# EAGLE board Module_BaseBoard _2.0 (EAGLE 9.2.1), part 1 of 3
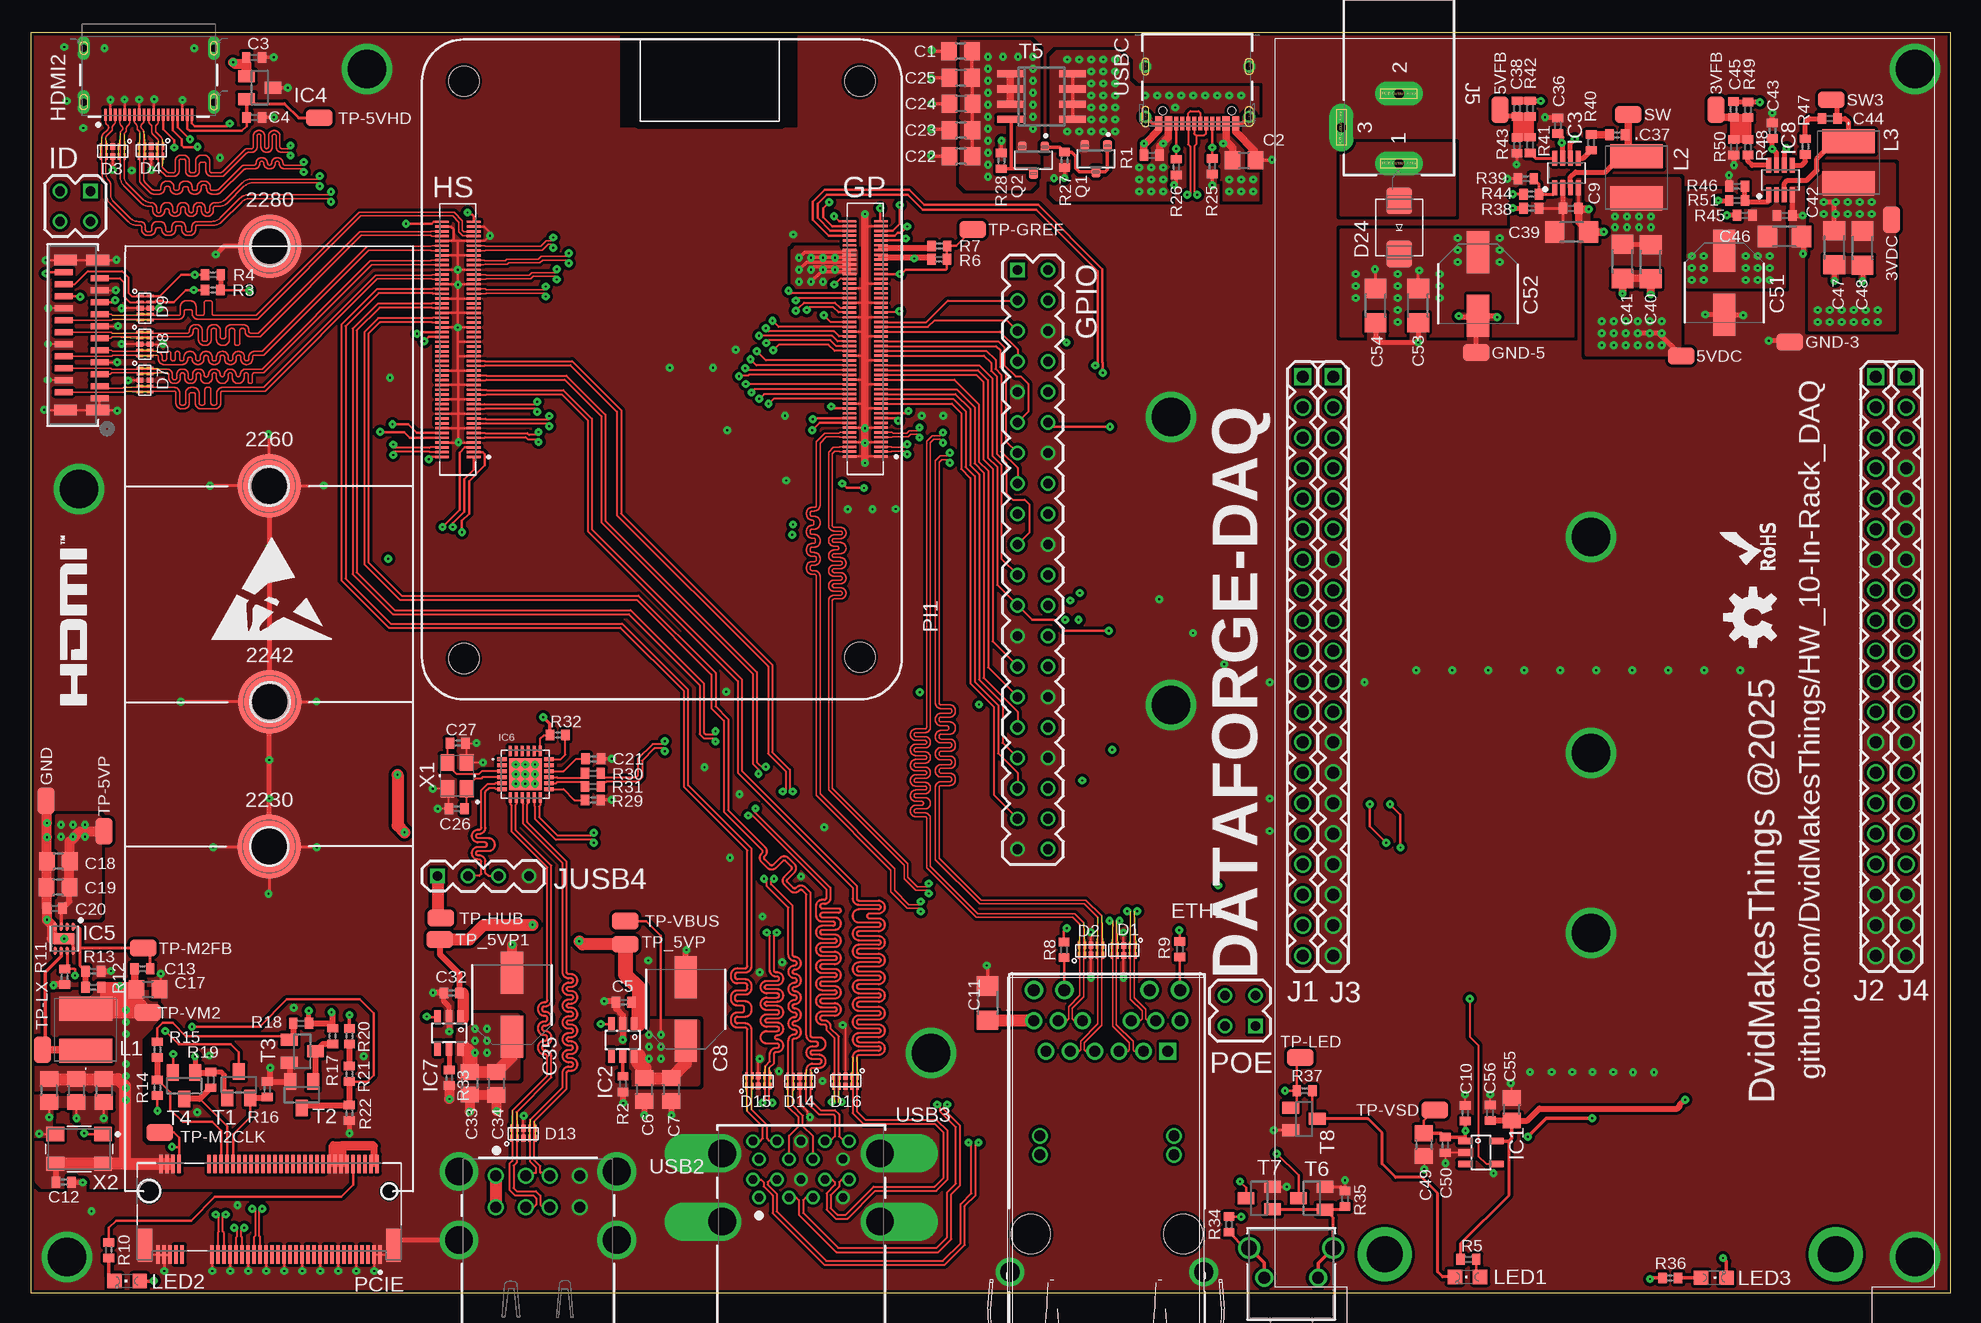
[diagram p7: board, top side]
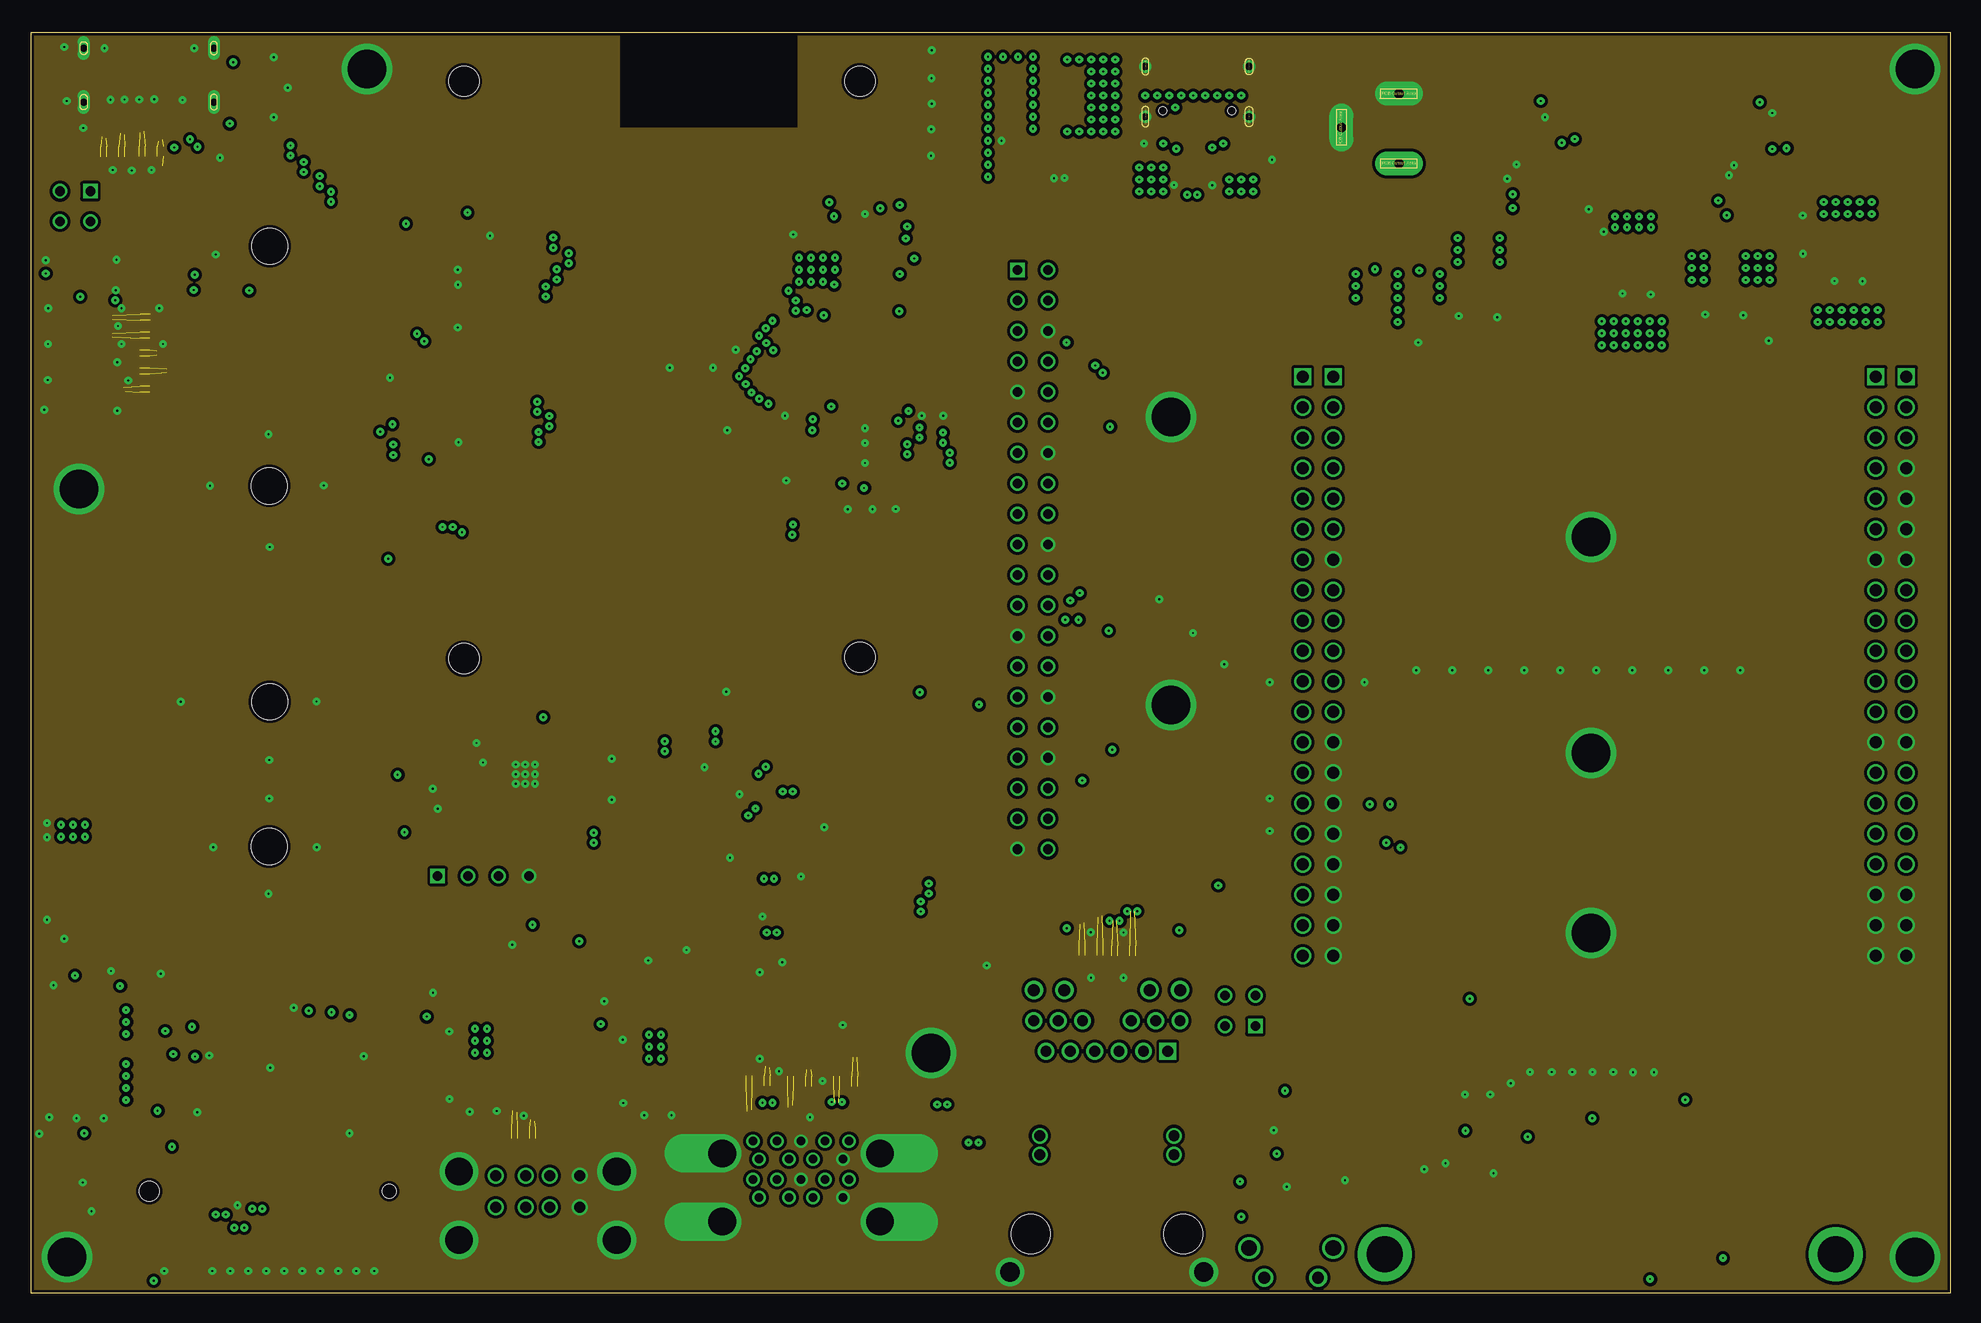
[diagram p8: board, inner layer L2-GND]
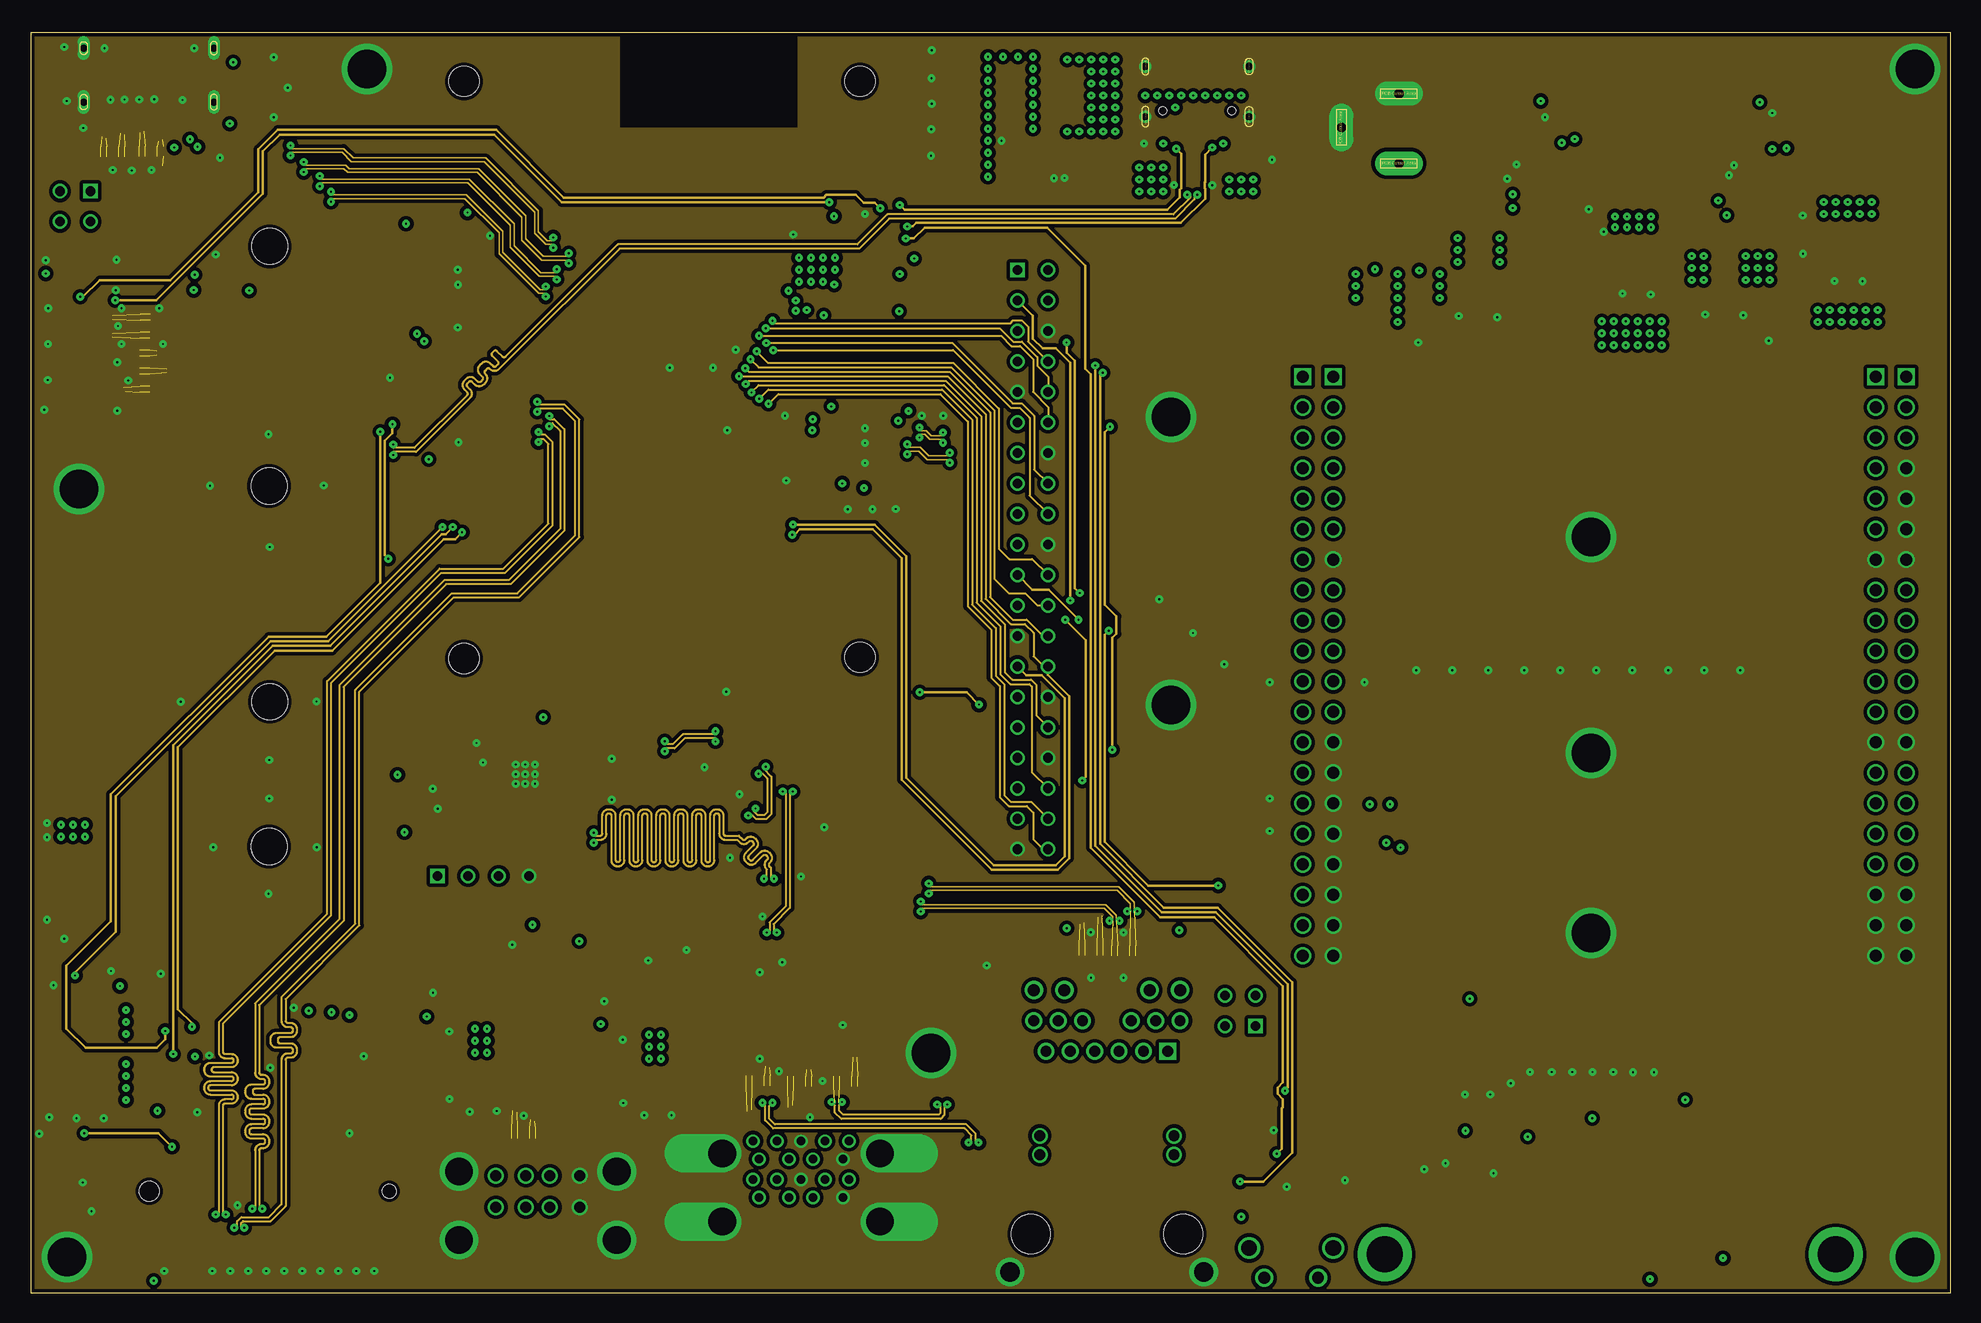
[diagram p9: board, inner layer L3-HS]
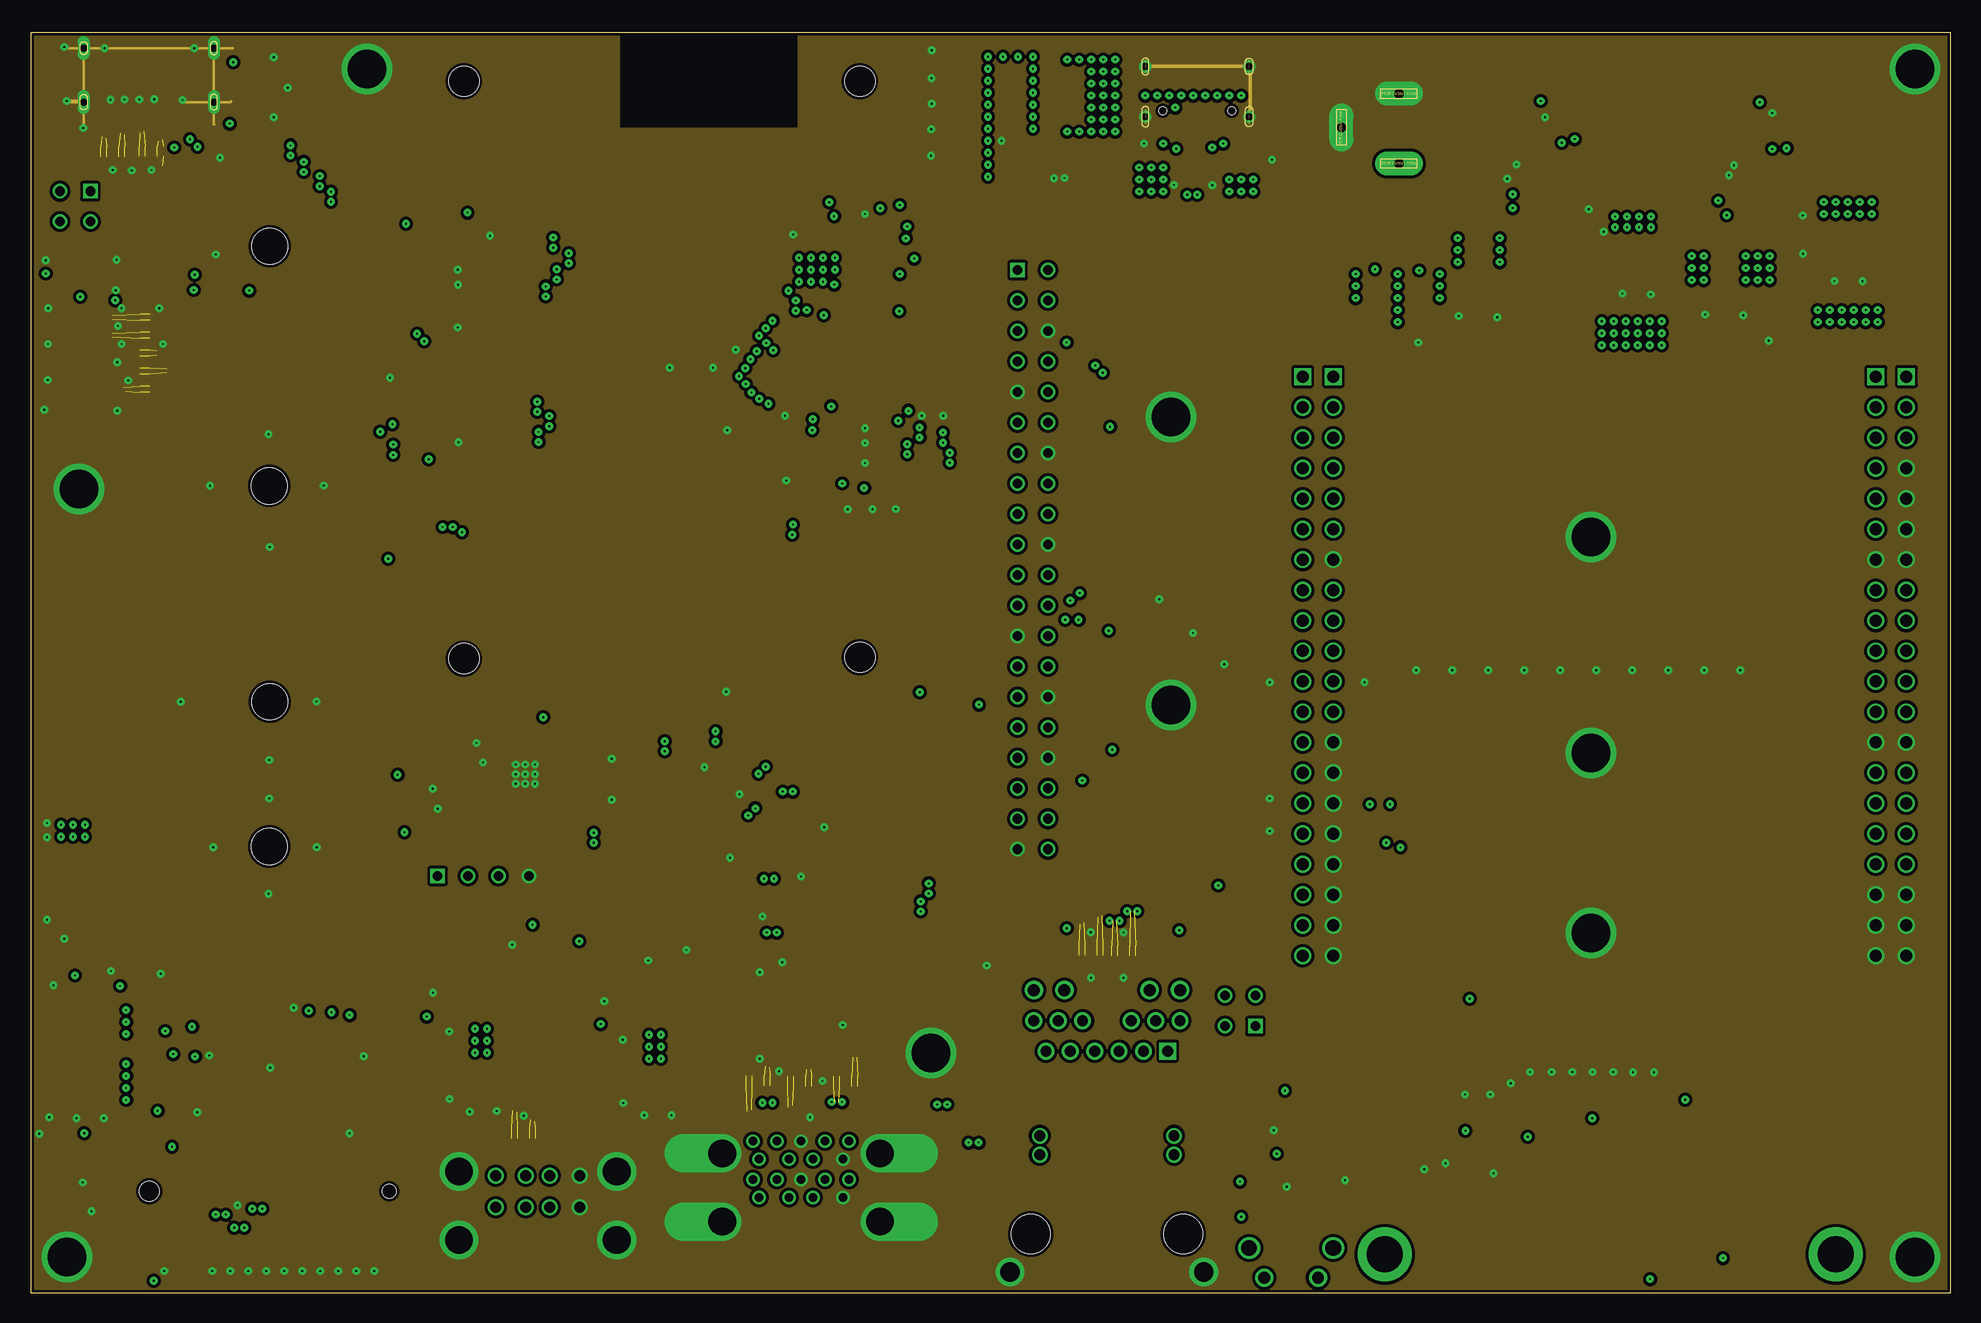
[diagram p10: board, inner layer L4-GND]
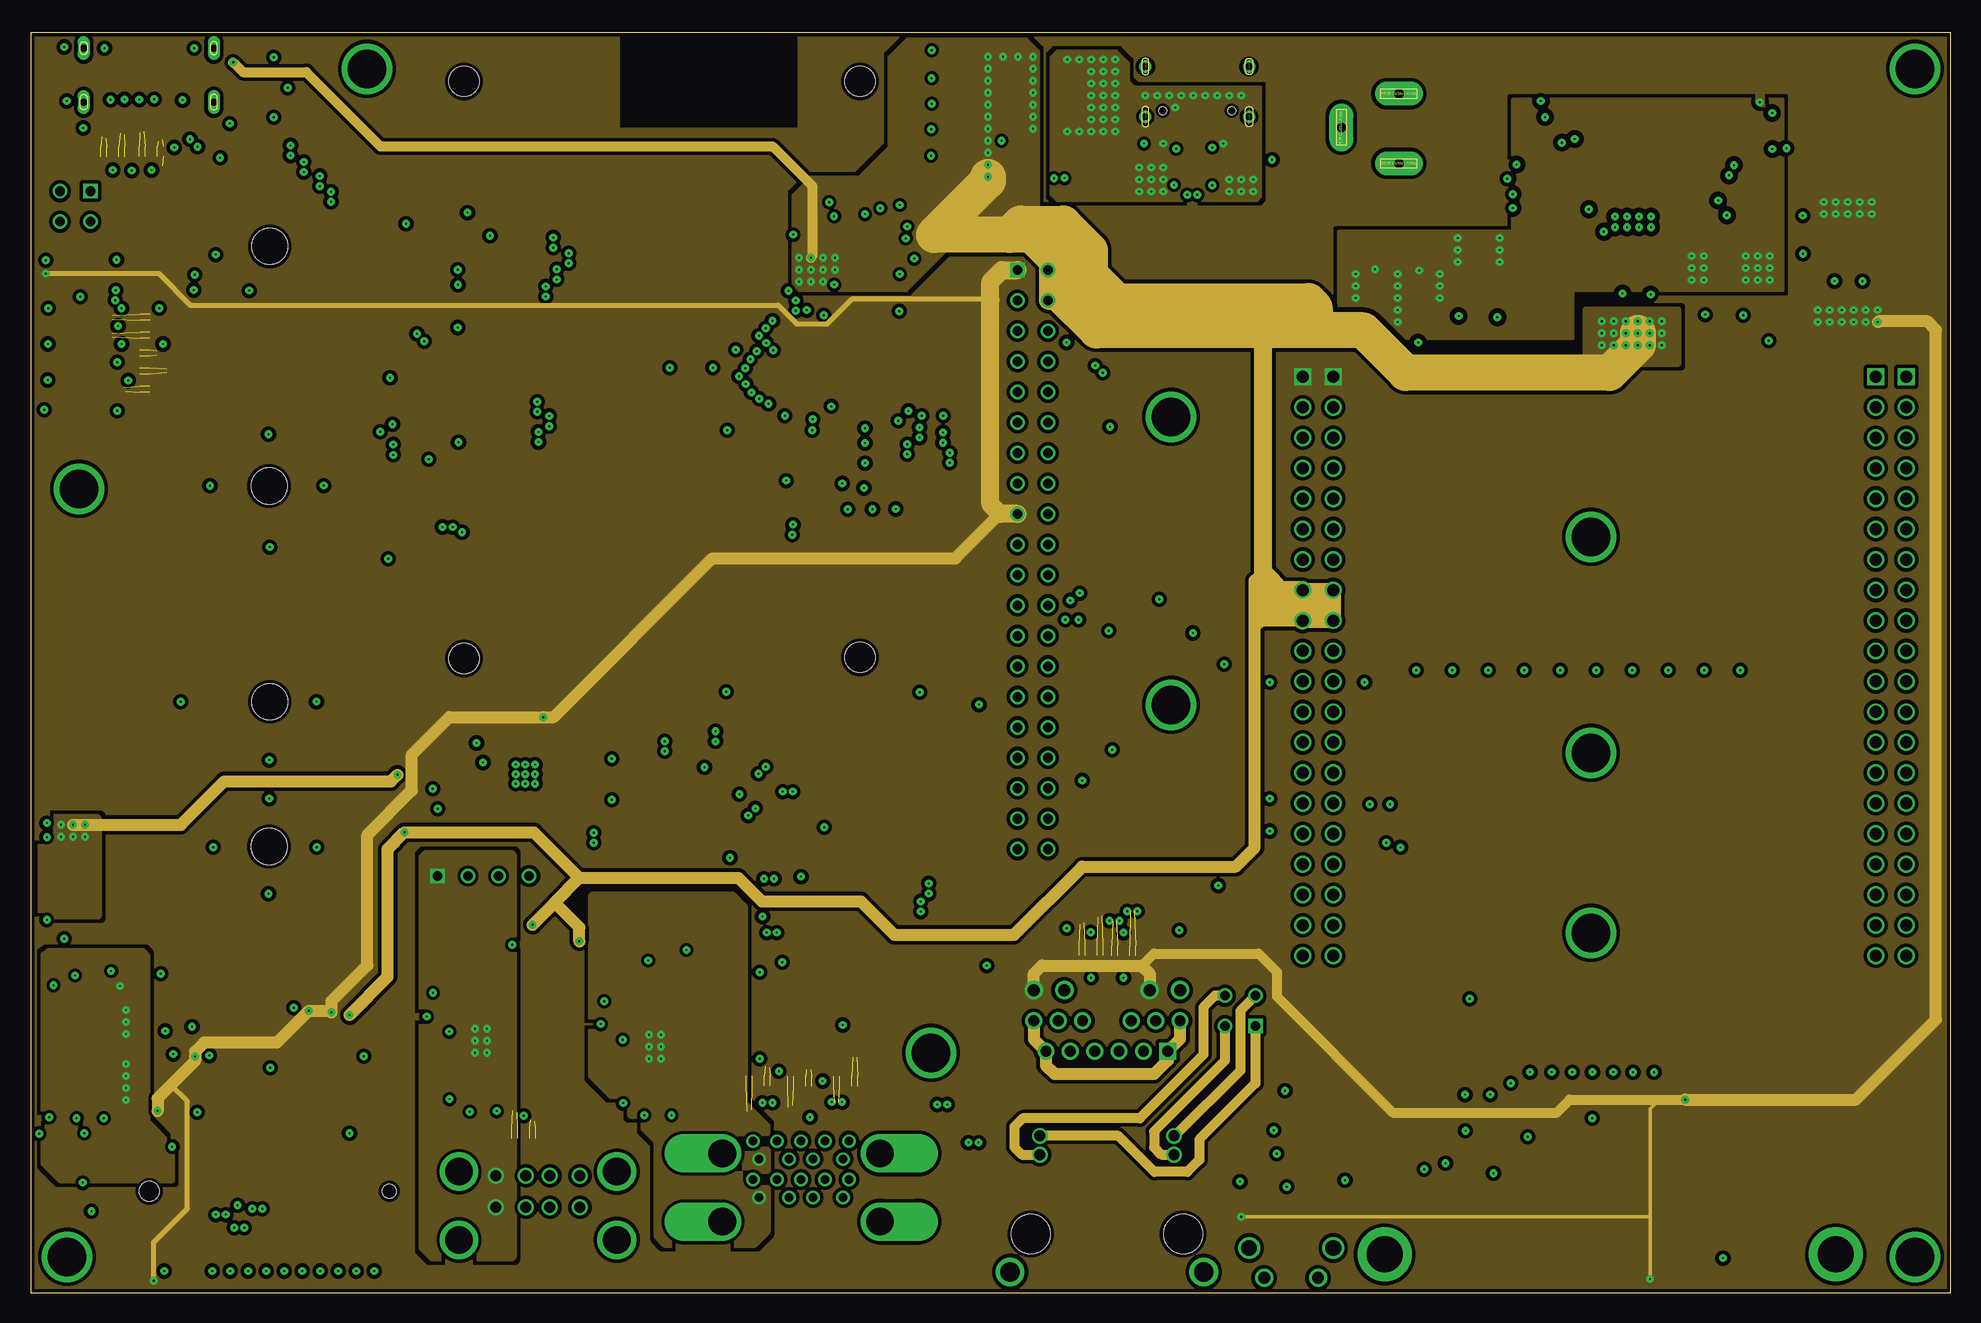
[diagram p11: board, inner layer L5_PWR]
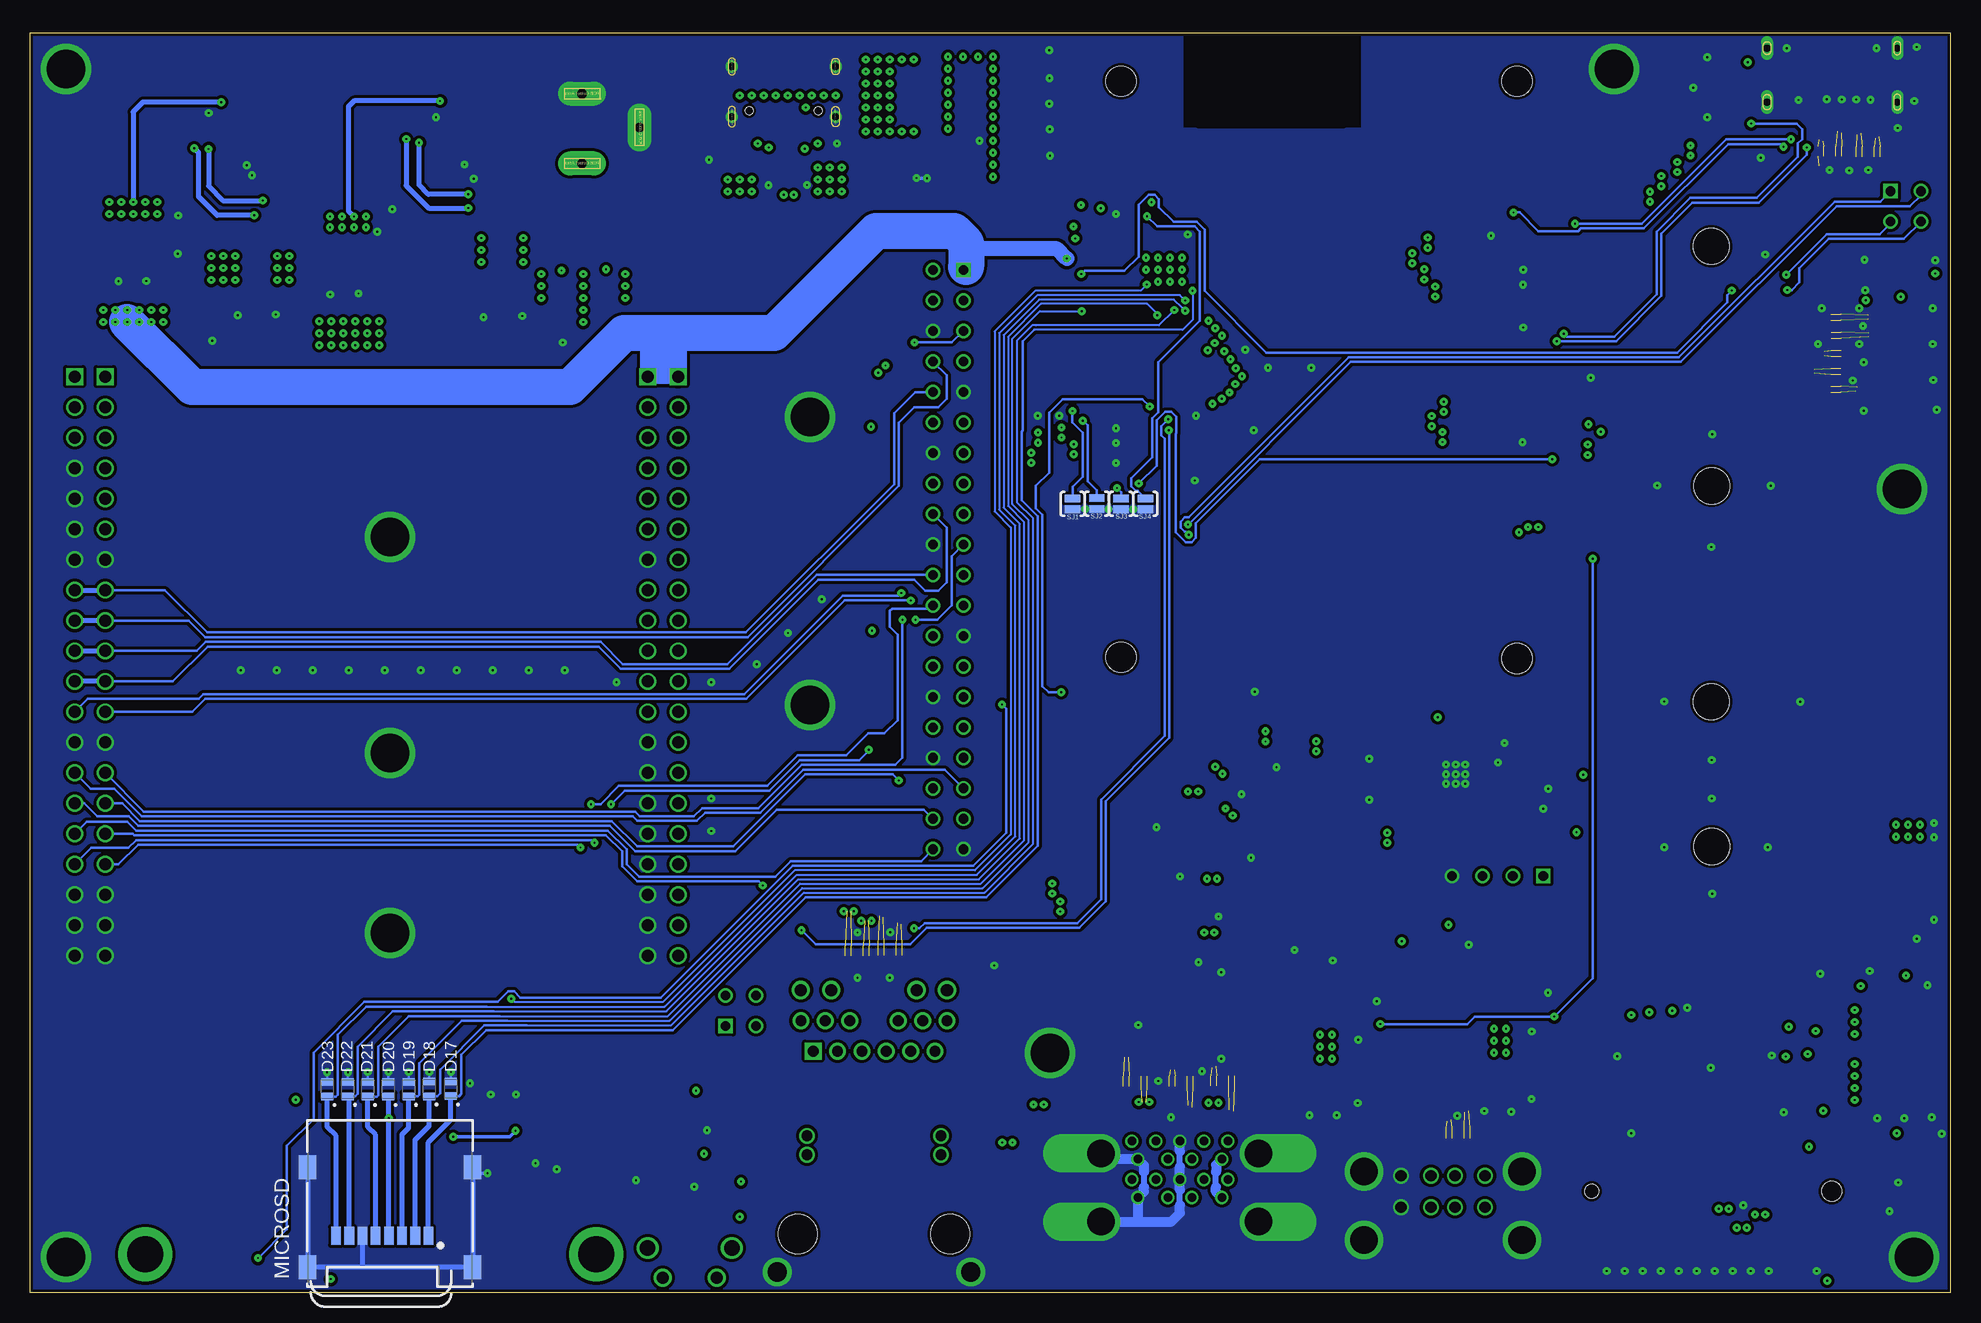
[diagram p12: board, bottom side, seen from below]

Size 160 x 105 mm. Coordinates in mm from the lower left corner, seen from the top.
Outline: 0,0 160,0 160,105 0,105 0,0
Copper layers (1+2*3+14*15+16): L1-HS 0.035mm / dielectric 0.0994mm / L2-GND 0.0152mm / dielectric 0.55mm / L3-HS 0.0152mm / dielectric 0.1088mm / L4-GND 0.0152mm / dielectric 0.55mm / L5_PWR 0.0152mm / dielectric 0.0994mm / L6-SS 0.035mm
Design rules "JLC06161H-3313_6-layer *": minimum track width 3.5mil, minimum drill 0.15mm, track to track 3.5mil, track to pad 3.5mil, pad to pad 3.5mil, via to via 3.5mil, smd to smd 3.5mil, copper to edge 0.2mm, drill to drill 6mil, minimum pad ring 8mil, minimum via ring 0.25mm, stop-mask expansion 0.05mm, vias tented up to drill 16mil, thermal gap 10mil
Net classes: 0 default: width 0.18 mm, drill 0.15 mm, clearance 0.191 mm; 1 50R_DIFFPAIR: width 0.446 mm, drill 0.15 mm, clearance 0.191 mm; 2 90R_DIFFPAIR: width 0.155 mm, drill 0.15 mm, clearance 0.191 mm; 3 100R_DIFFPAIR: width 0.121 mm, drill 0.15 mm, clearance 0.191 mm

## Footprints (pad centres in the part's own frame; a part is rotated, then mirrored left to right if it is on the bottom)
TP = smd 2.2 x 1.4: TP 0,0
WA-SMSI_9774010243 = smd 5.3 x 5.3: 1 0,0 | hole 3: 0,0
C0805 = smd 1.3 x 1.5: 1 -0.95,0; 2 0.95,0
C0402 = smd 0.7 x 0.9: 1 -0.65,0; 2 0.65,0
100UF-16V = smd 3.5 x 1.85: 1 -2.65,0; 2 2.65,0
0402 = smd 0.7 x 0.9: 1 -0.65,0; 2 0.65,0
C1206 = smd 1.6 x 1.803: 1 -1.422,0; 2 1.422,0
USON = smd 0.57 x 0.2: 1 -0.4,1; 2 -0.4,0.5; 4 -0.4,-0.5; 5 -0.4,-1; 6 0.435,-1; 7 0.435,-0.5; 9 0.435,0.5; 10 0.435,1 | smd 0.57 x 0.4: 3 -0.4,0; 8 0.435,0
WE-TVS_DFN1610-2L = smd 0.625 x 1: 1 -0.613,0; 2 0.613,0
SMB = smd 2.17 x 2.14: A 2.215,0; C -2.215,0
FH12-22S-0.5SH = smd 0.5 x 1.5: 1 5.251,2.244; 2 4.751,-0.756; 3 4.251,2.244; 4 3.751,-0.756; 5 3.251,2.244; 6 2.751,-0.756; 7 2.251,2.244; 8 1.75,-0.756; 9 1.25,2.244; 10 0.75,-0.756; 11 0.25,2.244; 12 -0.25,-0.756; 13 -0.75,2.244; 14 -1.25,-0.756; 15 -1.75,2.244; 16 -2.251,-0.756; 17 -2.751,2.244; 18 -3.251,-0.756; 19 -3.751,2.244; 20 -4.251,-0.756; 21 -4.751,2.244; 22 -5.251,-0.756 | smd 0.889 x 1.905: 23 -6.25,2.091; 24 6.25,2.091; 25 -6.25,-0.604; 26 6.25,-0.604
RJ45-CAT6-POE = drill 1.02 pad 1.53: 17 6.11,15.24; 18 3.57,15.24; 19 -3.54,15.24; 20 -6.08,15.24 | drill 0.9 pad 1.4: CT1 -6.08,12.7; CT2 -5.07,10.16; CT4 6.1,12.7; TD1+ -4.05,12.7; TD1- -2.02,12.7; TD2+ -1.01,10.16; TD2- -3.04,10.16; TD3+ 1.02,10.16; TD3- 3.05,10.16; TD4+ 4.07,12.7; TD4- 2.04,12.7 | drill 0.9 pad 1.4 square: CT3 5.08,10.16 | drill 1.6 pad 2.4: MH3 -8.06,-8.25; MH4 8.08,-8.25 | drill 0.9 pad 1.25: VC1 5.6,3.1; VC2 -5.58,3.1; VC3 5.6,1.53; VC4 -5.58,1.53 | hole 3.25: -6.34,-5.08; 6.36,-5.08
2X20 = drill 0.8 square: 1 -1.27,24.13 | drill 0.8: 2 1.27,24.13; 3 -1.27,21.59; 4 1.27,21.59; 5 -1.27,19.05; 6 1.27,19.05; 7 -1.27,16.51; 8 1.27,16.51; 9 -1.27,13.97; 10 1.27,13.97; 11 -1.27,11.43; 12 1.27,11.43; 13 -1.27,8.89; 14 1.27,8.89; 15 -1.27,6.35; 16 1.27,6.35; 17 -1.27,3.81; 18 1.27,3.81; 19 -1.27,1.27; 20 1.27,1.27; 21 -1.27,-1.27; 22 1.27,-1.27; 23 -1.27,-3.81; 24 1.27,-3.81; 25 -1.27,-6.35; 26 1.27,-6.35; 27 -1.27,-8.89; 28 1.27,-8.89; 29 -1.27,-11.43; 30 1.27,-11.43; 31 -1.27,-13.97; 32 1.27,-13.97; 33 -1.27,-16.51; 34 1.27,-16.51; 35 -1.27,-19.05; 36 1.27,-19.05; 37 -1.27,-21.59; 38 1.27,-21.59; 39 -1.27,-24.13; 40 1.27,-24.13
685119136923 = smd 0.23 x 1: 1 3.6,1.05; 2 3.2,1.05; 3 2.8,1.05; 4 2.4,1.05; 5 2,1.05; 6 1.6,1.05; 7 1.2,1.05; 8 0.8,1.05; 9 0.4,1.05; 10 0,1.05; 11 -0.4,1.05; 12 -0.8,1.05; 13 -1.2,1.05; 14 -1.6,1.05; 15 -2,1.05; 16 -2.4,1.05; 17 -2.8,1.05; 18 -3.2,1.05; 19 -3.6,1.05 | drill 0.6 pad 0.9 long: S1 5.425,0; S2 -5.425,0 | drill 0.6 pad 0.8 long: S3 -5.425,-4.5; S4 5.425,-4.5
SOT23-5 = smd 0.55 x 1.2: 1 -0.95,-1.3; 2 0,-1.3; 3 0.95,-1.3; 4 0.95,1.3; 5 -0.95,1.3
SOT23-6 = smd 0.55 x 1.2: 1 -0.95,-1.3; 2 0,-1.3; 3 0.95,-1.3; 4 0.95,1.3; 5 0,1.3; 6 -0.95,1.3
SOT65P280X110-8N = smd 1.259 x 0.4: 1 -1.228,0.975; 2 -1.228,0.325; 3 -1.228,-0.325; 4 -1.228,-0.975; 5 1.228,-0.975; 6 1.228,-0.325; 7 1.228,0.325; 8 1.228,0.975
SOT23 = smd 1 x 1.4: 1 -0.95,-1.1; 2 0.95,-1.1; 3 0,1.1
SON50P201X201X56-9T90X170N = smd 0.715 x 0.27: 1 -1.001,0.75; 2 -1.001,0.25; 3 -1.001,-0.25; 4 -1.001,-0.75; 5 1.001,-0.75; 6 1.001,-0.25; 7 1.001,0.25; 8 1.001,0.75 | smd 0.9 x 1.7: 9 0,0
QFN24 = smd 0.81 x 0.26: 1 -1.955,1.25; 2 -1.955,0.75; 3 -1.955,0.25; 4 -1.955,-0.25; 5 -1.955,-0.75; 6 -1.955,-1.25; 13 1.955,-1.25; 14 1.955,-0.75; 15 1.955,-0.25; 16 1.955,0.25; 17 1.955,0.75; 18 1.955,1.25 | smd 0.26 x 0.81: 7 -1.25,-1.955; 8 -0.75,-1.955; 9 -0.25,-1.955; 10 0.25,-1.955; 11 0.75,-1.955; 12 1.25,-1.955; 19 1.25,1.955; 20 0.75,1.955; 21 0.25,1.955; 22 -0.25,1.955; 23 -0.75,1.955; 24 -1.25,1.955 | smd 2.7 x 2.7: 25 0,0
2X2 = drill 0.8 square: 1 -1.27,1.27 | drill 0.8: 2 1.27,1.27; 3 -1.27,-1.27; 4 1.27,-1.27
1X20 = drill 1 square: 1 0,24.13 | drill 1: 2 0,21.59; 3 0,19.05; 4 0,16.51; 5 0,13.97; 6 0,11.43; 7 0,8.89; 8 0,6.35; 9 0,3.81; 10 0,1.27; 11 0,-1.27; 12 0,-3.81; 13 0,-6.35; 14 0,-8.89; 15 0,-11.43; 16 0,-13.97; 17 0,-16.51; 18 0,-19.05; 19 0,-21.59; 20 0,-24.13
694106301002 = drill 0.8 pad 2 long: 1 5.8,0; 2 0,0; 3 2.8,-4.8
1X4 = drill 0.8 square: 1 0,3.81 | drill 0.8: 2 0,1.27; 3 0,-1.27; 4 0,-3.81
SRR5228A = smd 4.4 x 2: 1 0,1.75; 2 0,-1.75
CHIPLED_0805 = smd 1.2 x 1.2: A 0,-1.05; C 0,1.05
693072010801 = smd 0.8 x 1.5: 1 3.2,-2.7; 2 2.1,-2.7; 3 1,-2.7; 4 -0.1,-2.7; 5 -1.2,-2.7; 6 -2.3,-2.7; 7 -3.4,-2.7; 8 -4.5,-2.7 | smd 1.45 x 2: S1 6.875,-5.3; S2 -6.875,-5.3; S3 -6.875,3; S4 6.875,3
PCIE_M.2 = smd 0.3 x 1.55: 1 9.25,-4.005; 2 9,3.545; 3 8.75,-4.005; 4 8.5,3.545; 5 8.25,-4.005; 6 8,3.545; 7 7.75,-4.005; 8 7.5,3.545; 9 7.25,-4.005; 10 7,3.545; 11 6.75,-4.005; 12 6.5,3.545; 13 6.25,-4.005; 14 6,3.545; 15 5.75,-4.005; 16 5.5,3.545; 17 5.25,-4.005; 18 5,3.545; 19 4.75,-4.005; 20 4.5,3.545; 21 4.25,-4.005; 22 4,3.545; 23 3.75,-4.005; 24 3.5,3.545; 25 3.25,-4.005; 26 3,3.545; 27 2.75,-4.005; 28 2.5,3.545; 29 2.25,-4.005; 30 2,3.545; 31 1.75,-4.005; 32 1.5,3.545; 33 1.25,-4.005; 34 1,3.545; 35 0.75,-4.005; 36 0.5,3.545; 37 0.25,-4.005; 38 0,3.545; 39 -0.25,-4.005; 40 -0.5,3.545; 41 -0.75,-4.005; 42 -1,3.545; 43 -1.25,-4.005; 44 -1.5,3.545; 45 -1.75,-4.005; 46 -2,3.545; 47 -2.25,-4.005; 48 -2.5,3.545; 49 -2.75,-4.005; 50 -3,3.545; 51 -3.25,-4.005; 52 -3.5,3.545; 53 -3.75,-4.005; 54 -4,3.545; 55 -4.25,-4.005; 56 -4.5,3.545; 57 -4.75,-4.005; 58 -5,3.545; 67 -7.25,-4.005; 68 -7.5,3.545; 69 -7.75,-4.005; 70 -8,3.545; 71 -8.25,-4.005; 72 -8.5,3.545; 73 -8.75,-4.005; 74 -9,3.545; 75 -9.25,-4.005 | smd 1.2 x 2.75: S1 10.35,-3.23; S2 -10.35,-3.23 | hole 1.15: 10,1.27 | hole 1.65: -10,1.27
CM5 = smd 1.14 x 0.2: 1 17.9,-7.22; 2 15.26,-7.22; 3 17.9,-6.82; 4 15.26,-6.82; 5 17.9,-6.42; 6 15.26,-6.42; 7 17.9,-6.02; 8 15.26,-6.02; 9 17.9,-5.62; 10 15.26,-5.62; 11 17.9,-5.22; 12 15.26,-5.22; 13 17.9,-4.82; 14 15.26,-4.82; 15 17.9,-4.42; 16 15.26,-4.42; 17 17.9,-4.02; 18 15.26,-4.02; 19 17.9,-3.62; 20 15.26,-3.62; 21 17.9,-3.22; 22 15.26,-3.22; 23 17.9,-2.82; 24 15.26,-2.82; 25 17.9,-2.42; 26 15.26,-2.42; 27 17.9,-2.02; 28 15.26,-2.02; 29 17.9,-1.62; 30 15.26,-1.62; 31 17.9,-1.22; 32 15.26,-1.22; 33 17.9,-0.82; 34 15.26,-0.82; 35 17.9,-0.42; 36 15.26,-0.42; 37 17.9,-0.02; 38 15.26,-0.02; 39 17.9,0.38; 40 15.26,0.38; 41 17.9,0.78; 42 15.26,0.78; 43 17.9,1.18; 44 15.26,1.18; 45 17.9,1.58; 46 15.26,1.58; 47 17.9,1.98; 48 15.26,1.98; 49 17.9,2.38; 50 15.26,2.38; 51 17.9,2.78; 52 15.26,2.78; 53 17.9,3.18; 54 15.26,3.18; 55 17.9,3.58; 56 15.26,3.58; 57 17.9,3.98; 58 15.26,3.98; 59 17.9,4.38; 60 15.26,4.38; 61 17.9,4.78; 62 15.26,4.78; 63 17.9,5.18; 64 15.26,5.18; 65 17.9,5.58; 66 15.26,5.58; 67 17.9,5.98; 68 15.26,5.98; 69 17.9,6.38; 70 15.26,6.38; 71 17.9,6.78; 72 15.26,6.78; 73 17.9,7.18; 74 15.26,7.18; 75 17.9,7.58; 76 15.26,7.58; 77 17.9,7.98; 78 15.26,7.98; 79 17.9,8.38; 80 15.26,8.38; 81 17.9,8.78; 82 15.26,8.78; 83 17.9,9.18; 84 15.26,9.18; 85 17.9,9.58; 86 15.26,9.58; 87 17.9,9.98; 88 15.26,9.98; 89 17.9,10.38; 90 15.26,10.38; 91 17.9,10.78; 92 15.26,10.78; 93 17.9,11.18; 94 15.26,11.18; 95 17.9,11.58; 96 15.26,11.58; 97 17.9,11.98; 98 15.26,11.98; 99 17.9,12.38; 100 15.26,12.38; 101 -16.041,-7.26; 102 -18.681,-7.26; 103 -16.041,-6.86; 104 -18.681,-6.86; 105 -16.041,-6.46; 106 -18.681,-6.46; 107 -16.041,-6.06; 108 -18.681,-6.06; 109 -16.041,-5.66; 110 -18.681,-5.66; 111 -16.041,-5.26; 112 -18.681,-5.26; 113 -16.041,-4.86; 114 -18.681,-4.86; 115 -16.041,-4.46; 116 -18.681,-4.46; 117 -16.041,-4.06; 118 -18.681,-4.06; 119 -16.041,-3.66; 120 -18.681,-3.66; 121 -16.041,-3.26; 122 -18.681,-3.26; 123 -16.041,-2.86; 124 -18.681,-2.86; 125 -16.041,-2.46; 126 -18.681,-2.46; 127 -16.041,-2.06; 128 -18.681,-2.06; 129 -16.041,-1.66; 130 -18.681,-1.66; 131 -16.041,-1.26; 132 -18.681,-1.26; 133 -16.041,-0.86; 134 -18.681,-0.86; 135 -16.041,-0.46; 136 -18.681,-0.46; 137 -16.041,-0.06; 138 -18.681,-0.06; 139 -16.041,0.34; 140 -18.681,0.34; 141 -16.041,0.74; 142 -18.681,0.74; 143 -16.041,1.14; 144 -18.681,1.14; 145 -16.041,1.54; 146 -18.681,1.54; 147 -16.041,1.94; 148 -18.681,1.94; 149 -16.041,2.34; 150 -18.681,2.34; 151 -16.041,2.74; 152 -18.681,2.74; 153 -16.041,3.14; 154 -18.681,3.14; 155 -16.041,3.54; 156 -18.681,3.54; 157 -16.041,3.94; 158 -18.681,3.94; 159 -16.041,4.34; 160 -18.681,4.34; 161 -16.041,4.74; 162 -18.681,4.74; 163 -16.041,5.14; 164 -18.681,5.14; 165 -16.041,5.54; 166 -18.681,5.54; 167 -16.041,5.94; 168 -18.681,5.94; 169 -16.041,6.34; 170 -18.681,6.34; 171 -16.041,6.74; 172 -18.681,6.74; 173 -16.041,7.14; 174 -18.681,7.14; 175 -16.041,7.54; 176 -18.681,7.54; 177 -16.041,7.94; 178 -18.681,7.94; 179 -16.041,8.34; 180 -18.681,8.34; 181 -16.041,8.74; 182 -18.681,8.74; 183 -16.041,9.14; 184 -18.681,9.14; 185 -16.041,9.54; 186 -18.681,9.54; 187 -16.041,9.94; 188 -18.681,9.94; 189 -16.041,10.34; 190 -18.681,10.34; 191 -16.041,10.74; 192 -18.681,10.74; 193 -16.041,11.14; 194 -18.681,11.14; 195 -16.041,11.54; 196 -18.681,11.54; 197 -16.041,11.94; 198 -18.681,11.94; 199 -16.041,12.34; 200 -18.681,12.34 | hole 2.5: -16.86,24.04; 16.14,24.04; -16.86,-24.06; 16.14,-23.96
SOT23' = smd 0.71 x 0.96: 1 -0.95,-1.075; 2 0.95,-1.075; 3 0,1.075
SJ_2S-NO = smd 0.635 x 1.27: 1 -0.45,0; 2 0.45,0
SW2_1825027-C_TEC = drill 0.991 pad 1.499: 1 0,0; 2 4.496,0 | drill 1.295 pad 1.803: 3 -1.245,2.489; 4 5.766,2.489
SO8 = smd 0.6 x 2.2: 1 -1.905,-2.6; 2 -0.635,-2.6; 3 0.635,-2.6; 4 1.905,-2.6; 5 1.905,2.6; 6 0.635,2.6; 7 -0.635,2.6; 8 -1.905,2.6
61400826021 = drill 0.92: 1 -3.5,7.11; 2 -1,7.11; 3 1,7.11; 4 3.5,7.11; 5 -3.5,4.49; 6 -1,4.49; 7 1,4.49; 8 3.5,4.49 | drill 2.3: S1 -6.57,7.46; S2 6.57,7.46; S3 -6.57,1.78; S4 6.57,1.78
692141030100 = drill 0.7: 1 -3.5,3.93; 2 -1,3.93; 3 1,3.93; 4 3.5,3.93; 5 4,5.43; 6 2,5.43; 7 0,5.43; 8 -2,5.43; 9 -4,5.43; 10 -3.5,7.13; 11 -1,7.13; 12 1,7.13; 13 3.5,7.13; 14 4,8.63; 15 2,8.63; 16 0,8.63; 17 -2,8.63; 18 -4,8.63 | drill 2.3 offset: S1 -6.57,7.61; S2 6.57,7.61; S3 6.57,1.93; S4 -6.57,1.93
629722000214 = smd 0.3 x 1.15: A1 -3.35,4.745; A4 -2.55,4.745; A5 -1.25,4.745; A6 -0.25,4.745; A7 0.25,4.745; A8 1.25,4.745; A9 2.55,4.745; A12 3.35,4.745; B1 3.05,4.745; B4 2.25,4.745; B5 1.75,4.745; B6 0.75,4.745; B7 -0.75,4.745; B8 -1.75,4.745; B9 -2.25,4.745; B12 -3.05,4.745 | drill 0.6 pad 1: S1 -4.32,4.18; S2 4.32,4.18; S3 -4.32,0; S4 4.32,0 | hole 0.65: -2.89,3.68; 2.89,3.68
WE-XTAL_CFPX-180 = smd 1.4 x 1.15: 1 -1.1,-0.8; 2 1.1,-0.8; 3 1.1,0.8; 4 -1.1,0.8
OSCCC500X320X130 = smd 1.487 x 1.187: 1 -1.988,-1.238; 2 1.988,-1.238; 3 1.988,1.238; 4 -1.988,1.238

## Placement (x,y rotation side)
3VDC  TP  [TP]  155.06,89.42 270 top
3VFB  TP  [TP]  140.42,98.59 90 top
5VDC  TP  [TP]  137.51,78.08 0 top
5VFB  TP  [TP]  122.42,98.59 90 top
2230  M2 x 1mm  [WA-SMSI_9774010243]  19.85,37.2 0 top
2242  M2 x 1mm  [WA-SMSI_9774010243]  19.9,49.26 0 top
2260  M2 x 1mm  [WA-SMSI_9774010243]  19.85,67.25 0 top
2280  M2 x 1mm  [WA-SMSI_9774010243]  19.9,87.21 0 top
C1  100nF  [C0805]  77.47,103.47 180 top
C2  10uF  [C0805]  101.08,94.38 0 top
C3  100nF  [C0402]  18.59,102.95 0 top
C4  100nF  [C0402]  18.62,97.95 0 top
C5  100nF  [C0402]  49.41,24.22 180 top
C6  10uF  [C0805]  51.1,16.95 270 top
C7  10uF  [C0805]  53.35,16.95 270 top
C8  100uF 16V  [100UF-16V]  54.57,23.64 90 top
C9  100nF  [0402]  128.32,90.38 0 top
C10  100nF  [C0402]  119.52,14.97 90 top
C11  100nF  [C1206]  79.72,24.14 90 top
C12  100nF  [C0402]  2.75,9.23 0 top
C13  4.7nF  [C0402]  9.29,27.01 0 top
C14  10uF  [C0805]  1.5,16.86 270 top
C15  10uF  [C0805]  3.78,16.86 270 top
C16  10uF  [C0805]  6.08,16.87 270 top
C17  10uF  [C0805]  9.75,25.3 0 top
C18  10uF  [C0805]  2.28,35.97 180 top
C19  10uF  [C0805]  2.26,33.8 180 top
C20  100nF  [C0402]  1.98,32.05 180 top
C21  100nF  [C0402]  46.87,44.51 0 top
C22  22uF  [C0805]  77.49,94.72 180 top
C23  10uF  [C0805]  77.5,96.89 180 top
C24  10uF  [C0805]  77.5,99.09 180 top
C25  10uF  [C0805]  77.48,101.25 180 top
C26  10pF  [C0402]  35.48,40.34 180 top
C27  10pF  [C0402]  35.56,45.81 0 top
C32  100nF  [C0402]  35.05,25 180 top
C33  10uF  [C0805]  36.55,17.46 270 top
C34  10uF  [C0805]  38.78,17.45 270 top
C35  100uF 16V  [100UF-16V]  40.09,24.01 90 top
C36  100nF  [0402]  127.25,97.27 90 top
C37  100nF  [0402]  132.19,96.5 0 top
C38  33pF  [0402]  123.83,98.69 270 top
C39  22uF 25V  [C1206]  128.4,88.41 0 top
C40  22uF - 10V  [C1206]  134.98,85.92 270 top
C41  22uF - 10V  [C1206]  132.63,85.96 270 top
C42  100nF  [0402]  146.15,89.78 0 top
C43  100nF  [0402]  145.12,96.84 90 top
C44  100nF  [0402]  149.9,97.86 0 top
C45  33pF  [0402]  141.88,98.62 270 top
C46  22uF 25V  [C1206]  146.13,88.03 0 top
C47  22uF - 10V  [C1206]  150.28,87.1 270 top
C48  22uF - 10V  [C1206]  152.63,87.06 270 top
C49  10uF  [C0805]  116.06,12.35 270 top
C50  100nF  [C0402]  117.86,12.33 270 top
C51  100uF  [100UF-16V]  141.1,84.17 270 top
C52  100uF  [100UF-16V]  120.58,84.08 270 top
C53  10uF  [C1206]  115.61,82.28 270 top
C54  100nF  [C1206]  112.06,82.27 270 top
C55  10uF  [C0805]  123.4,15.3 90 top
C56  100nF  [C0402]  121.6,15 90 top
D1  TPD4EUSB30  [USON]  91.06,28.55 270 top
D2  TPD4EUSB30  [USON]  88.33,28.52 90 top
D3  TPD4EUSB30  [USON]  6.82,95.13 270 top
D4  TPD4EUSB30  [USON]  10.02,95.16 270 top
D7  TPD4EUSB30  [USON]  9.48,76.06 0 top
D8  TPD4EUSB30  [USON]  9.48,79.06 0 top
D9  TPD4EUSB30  [USON]  9.5,82.06 0 top
D13  TPD4EUSB30  [USON]  41.04,13.28 90 top
D14  TPD4EUSB30  [USON]  64.06,17.65 270 top
D15  TPD4EUSB30  [USON]  60.62,17.64 90 top
D16  TPD4EUSB30  [USON]  67.89,17.66 270 top
D17  5Vdc  [WE-TVS_DFN1610-2L]  124.94,17 90 bottom
D18  5Vdc  [WE-TVS_DFN1610-2L]  126.74,16.99 90 bottom
D19  5Vdc  [WE-TVS_DFN1610-2L]  128.44,16.98 90 bottom
D20  5Vdc  [WE-TVS_DFN1610-2L]  130.14,16.97 90 bottom
D21  5Vdc  [WE-TVS_DFN1610-2L]  131.84,16.96 90 bottom
D22  5Vdc  [WE-TVS_DFN1610-2L]  133.52,16.98 90 bottom
D23  5Vdc  [WE-TVS_DFN1610-2L]  135.22,16.97 90 bottom
D24  SS54B  [SMB]  114.02,88.78 90 top
DISP0  FH12-22S-0.5SVA  [FH12-22S-0.5SH]  3.48,79.81 270 top
ETH1  G16LX-188S7-1G-GO-Y  [RJ45-CAT6-POE]  89.66,9.98 0 top
GND  TP  [TP]  1.27,41.02 90 top
GND-3  TP  [TP]  146.58,79.25 0 top
GND-5  TP  [TP]  120.44,78.35 0 top
GPIO  [2X20]  83.49,61.1 0 top
HDMI2  685119136923  [685119136923]  9.82,99.23 180 top
IC1  RT9742GGJ  [SOT23-5]  120.84,11.7 270 top
IC2  AP22653W6  [SOT23-6]  49.32,21.07 180 top
IC3  MP2315GJ-Z  [SOT65P280X110-8N]  127.97,93.33 90 top
IC4  RT9742NGV  [SOT23]  19.07,100.43 270 top
IC5  AP3441SHE-7B  [SON50P201X201X56-9T90X170N]  2.77,29.52 270 top
IC6  [QFN24]  41.2,43.22 0 top
IC7  AP22653W6  [SOT23-6]  34.84,21.67 180 top
IC8  MP2315S  [SOT65P280X110-8N]  145.79,92.72 90 top
ID  [2X2]  3.69,90.53 270 top
J1  [1X20]  105.98,52.22 0 top
J2  [1X20]  153.74,52.22 0 top
J3  [1X20]  108.52,52.22 0 top
J4  [1X20]  156.28,52.22 0 top
J5  694106301002  [694106301002]  114,99.93 270 top
JUSB4  [1X4]  37.7,34.74 90 top
L1  L  [SRR5228A]  4.56,21.93 180 top
L2  4.9uH  [SRR5228A]  133.79,92.95 0 top
L3  4.2uH  [SRR5228A]  151.47,94.2 0 top
LED1  Green  [CHIPLED_0805]  119.71,1.33 90 top
LED2  [CHIPLED_0805]  8.02,0.98 90 top
LED3  Green  [CHIPLED_0805]  140.24,1.26 270 top
MICROSD  693072010801  [693072010801]  130,7.45 0 bottom
PCIE  M.2  [PCIE_M.2]  19.85,7.2 0 top
PI1  [CM5]  52.94,76.92 0 top
POE  POE  [2X2]  100.77,23.5 180 top
Q1  MMBT3906  [SOT23']  88.75,94.5 180 top
Q2  MMBT3906  [SOT23']  83.55,94.39 180 top
R1  2.2K 1%  [0402]  93.4,94.8 180 top
R2  15K 1%  [0402]  49.33,17.41 270 top
R3  2.2K 1%  [0402]  15.14,83.57 180 top
R4  2.2K 1%  [0402]  15.16,84.84 180 top
R5  1K  [0402]  119.8,2.79 0 top
R6  0R  [0402]  75.69,86.14 0 top
R7  DNI  [0402]  75.7,87.24 0 top
R8  470R  [0402]  86.08,28.59 270 top
R9  470R  [0402]  95.74,28.64 90 top
R10  1K  [0402]  6.49,3.56 90 top
R11  100K 1%  [0402]  2.81,26.36 270 top
R12  10K 1%  [0402]  5.21,25.47 180 top
R13  2.2K 1%  [0402]  5.19,26.8 0 top
R14  10K  [0402]  10.54,17.11 90 top
R15  NC  [0402]  10.54,20.27 90 top
R16  2.2K  [0402]  19.69,16.96 90 top
R17  10K  [0402]  25.14,21.41 270 top
R18  10K  [0402]  22.51,22.46 180 top
R19  10K  [0402]  14.99,17.74 270 top
R20  NC  [0402]  26.54,21.39 270 top
R21  3.6K 1%  [0402]  26.53,18.25 270 top
R22  6.8K 1%  [0402]  26.53,15 270 top
R25  NC  [0402]  98.44,93.89 270 top
R26  NC  [0402]  95.44,93.81 270 top
R27  100K  [0402]  86.14,94.42 270 top
R28  470K  [0402]  80.86,94.33 90 top
R29  NC  [0402]  46.83,41.06 0 top
R30  2.2R  [0402]  46.83,43.29 180 top
R31  2.2R  [0402]  46.84,42.19 180 top
R32  100K  [0402]  43.9,46.48 0 top
R33  15K 1%  [0402]  34.85,17.93 270 top
R34  1K  [0402]  99.84,5.7 270 top
R35  1K  [0402]  109.51,7.84 90 top
R36  1K  [0402]  136.62,1.24 0 top
R37  NC  [0402]  106.14,16.84 0 top
R38  499K  [0402]  125.03,90.39 180 top
R39  9.09K  [0402]  124.58,92.84 180 top
R40  10R  [0402]  130.01,95.87 270 top
R41  20K  [0402]  124.94,95.65 90 top
R42  40.2K  [0402]  124.94,98.69 270 top
R43  7.5K  [0402]  123.83,95.62 270 top
R44  100K  [0402]  125.03,91.56 0 top
R45  499K  [0402]  142.82,89.79 180 top
R46  7.5K  [0402]  142.18,92.22 180 top
R47  10R  [0402]  147.87,95.53 270 top
R48  33K  [0402]  143.09,95.47 90 top
R49  40.2K  [0402]  143.09,98.59 270 top
R50  12.7K  [0402]  141.91,95.47 270 top
R51  100K  [0402]  142.18,91.03 0 top
SJ1  SOLDERJUMPERNO  [SJ_2S-NO]  73.12,65.75 90 bottom
SJ2  SOLDERJUMPERNO  [SJ_2S-NO]  71.1,65.78 90 bottom
SJ3  SOLDERJUMPERNO  [SJ_2S-NO]  69.08,65.75 90 bottom
SJ4  SOLDERJUMPERNO  [SJ_2S-NO]  67.05,65.75 90 bottom
SW  TP  [TP]  133.12,98.2 0 top
SW1  1825027-8  [SW2_1825027-C_TEC]  102.76,1.25 0 top
SW3  TP  [TP]  150.02,99.43 0 top
T1  BSS138  [SOT23]  17.32,17.34 0 top
T2  BSS138  [SOT23]  22.57,16.51 180 top
T3  BSS138  [SOT23]  22.61,20.14 270 top
T4  BSS138  [SOT23]  12.76,17.26 180 top
T5  AO4407A  [SO8]  84.21,99.69 270 top
T6  BSS138  [SOT23]  106.73,7.89 90 top
T7  BSS138  [SOT23]  102.36,7.9 90 top
T8  BSS138  [SOT23]  106.09,14.49 270 top
TP-5VHD  TP  [TP]  24.02,97.92 0 top
TP-5VP  TP  [TP]  6.08,38.45 90 top
TP-GREF  TP  [TP]  78.48,88.62 0 top
TP-HUB  TP  [TP]  34.13,31.25 0 top
TP-LED  TP  [TP]  105.79,19.6 0 top
TP-LX  TP  [TP]  0.97,20.27 90 top
TP-M2CLK  TP  [TP]  10.71,13.38 0 top
TP-M2FB  TP  [TP]  9.34,28.73 0 top
TP-VBUS  TP  [TP]  49.52,30.98 0 top
TP-VM2  TP  [TP]  9.74,23.35 0 top
TP-VSD  TP  [TP]  116.97,15.25 180 top
TP_5VP  TP  [TP]  49.52,29.05 0 top
TP_5VP1  TP  [TP]  34.09,29.45 0 top
U$1  [ESD_10.00]  14.98,54.34 0 top
U$2  [OSHW-LOGO-M]  143.5,56.3 90 top
U$3  [ROHS_LOGO_0.18_IN]  145.48,60.07 90 top
USB2  61400826021  [61400826021]  42.25,2.64 0 top
USB3  692141030100  [692141030100]  64.18,4.01 0 top
USBC  629722000214  [629722000214]  97.19,102.2 180 top
X1  12MHz  [WE-XTAL_CFPX-180]  35.52,43.1 90 top
X2  CRYSTAL  [OSCCC500X320X130]  4.01,11.99 180 top

## Tracks (layer width: path | path; a pad name or v marks a point on that pad's centre or on a via)
5VFB
  L1-HS 0.254: 124.7,98.04 124.83,98.04 R42.2
  L1-HS 0.406: R41.2 124.94,97.15 124.94,97.93 | 123.83,96.53 R43.1 | 124.62,98.04 124.7,98.04 | C38.2 122.97,98.04 5VFB.TP
  L1-HS 0.61: C38.2 123.83,96.53 | R43.1 123.86,96.3 124.25,96.3 | 124.25,96.3 R41.2 | C38.2 124.62,98.04 | 124.62,98.04 124.83,98.04 124.94,97.93 | R42.2 124.94,97.15 | 124.94,97.15 R41.2 | R41.2 124.62,96.61 124.62,98.04 | C38.2 124.25,97.62 124.25,96.3 | 124.94,97.15
+1V8
  L1-HS 0.2: PI1.87 70.84,87.1 PI1.89
  L1-HS 0.508: 70.84,87.1 74.92,87.1 R7.1
+3V3  (via drill 0.15)
  L1-HS 0.18: R32.1 42.73,46.48 42.45,46.2 IC6.19 IC6.20
  L1-HS 0.2: PI1.85 70.84,86.3 PI1.83 | R34.1 v100.85,6.35 | DISP0.22 1.34,85.06 v1.23,84.95
  L1-HS 0.203: R14.1 10.54,15.19 v10.55,15.18
  L1-HS 0.254: R5.1 119.14,4.12 123.17,8.15 123.17,12.68
  L1-HS 0.305: LED2.A 10.21,0.98 v10.22,1 | C55.1 123.4,12.9 123.17,12.68 123.15,12.65 IC1.5 | R36.1 135.01,1.24 v134.93,1.15 | R32.1 43.24,47.43 v42.7,47.98
  L1-HS 0.406: v13.68,19.7 13.68,18.39 T4.1 | T1.1 16.12,16.49 16.12,18.15 15.88,18.39 R19.1 | R18.1 v23.16,23.49 v23.15,23.5 | C47.1 150.28,90.9 v149.4,90.9 | C45.1 143.09,99.27 R49.1 144.06,99.25 v144.07,99.22
  L1-HS 0.508: T4.1 14.96,18.36 R19.1 | R18.1 24.73,22.46 R17.1 25.14,23.29 v25.05,23.38 | 70.84,86.3 73.6,86.3 | 73.6,86.3 74.88,86.3 R6.1 | 73.6,86.3 v73.6,86.19 | C56.1 C55.1 124.7,14.35 125.7,15.35 137.2,15.35 137.38,15.53 137.38,15.62 v137.85,16.1
  L5_PWR 0.305: v134.93,1.15 134.93,6.33 | 134.93,6.33 134.93,15.32 135.7,16.1 v137.85,16.1 | v100.85,6.35 134.9,6.35 134.93,6.33
  L5_PWR 0.406: v1.23,84.95 10.65,84.95 13.29,82.31 62.26,82.31 63.81,80.76 66.37,80.76 68.44,82.83 79.85,82.83 79.95,82.72 | v10.22,1 10.22,4.22 13.03,7.03 13.03,15.95 11.66,17.31
  L5_PWR 0.813: 92.58,27.27 93.58,28.27 102.3,28.27 103.83,26.75 103.83,24.7 113.5,15.03 127.15,15.03 128.22,16.1 v137.85,16.1
  L5_PWR 1.016: ETH1.20 83.58,26.6 84.25,27.27 92.58,27.27 93.22,26.62 ETH1.18 | v137.85,16.1 152.07,16.1 158.75,22.77 158.75,80.25 158.05,80.95 153.95,80.95 v153.9,80.9 | 80.74,64.91 77.03,61.2 56.77,61.2 43.55,47.98 v42.7,47.98 34.88,47.98 31.75,44.85 31.75,41.88 28.02,38.15 28.02,27.3 25.05,24.32 v25.05,23.38 24.93,23.5 v23.15,23.5 20.5,20.85 14.43,20.85 13.68,20.1 v13.68,19.7 13.68,19.32 11.66,17.31 10.55,16.2 v10.55,15.18
  L5_PWR 1.5: GPIO.17 80.74,64.91 79.95,65.7 79.95,82.72 79.95,84.28 80.91,85.23 GPIO.1
  L6-SS 0.406: v144.07,99.22 150.6,99.22 151.4,98.42 v151.4,90.9
  L6-SS 1.016: 82,85.5 82,85.45 GPIO.1
  L6-SS 1.27: v73.6,86.19 74.41,87 81.5,87 82,87.5 | J1.1 107,76.35 | 107,76.35 J3.1 | 107,76.35 107,79.15 106.15,80 | J3.1 108,76.87 108,80 | J3.1 108.52,78.48 108.5,78.5
  L6-SS 1.5: J1.1 105.98,79.83 106.15,80
  L6-SS 3: v151.9,80.9 146.5,75.5 115,75.5 110.5,80 108,80 106.15,80 98,80 89.5,88.5 83,88.5 82,87.5 82,85.5
  other vias: 149.4,89.9 150.4,89.9 150.4,90.9 152.4,90.9 153.4,90.9 151.4,89.9 152.4,89.9 153.4,89.9 148.9,81.9 149.9,81.9 150.9,81.9 151.9,81.9 152.9,81.9 153.9,81.9 152.9,80.9 150.9,80.9 149.9,80.9 148.9,80.9
  pour L1-HS (isolate 0.254, rank 3, no thermals): 148.9,94 155.2,94 155.2,82 155.2,80.3 148.6,80.3 148.3,80.3 148.3,93.8 148.3,94 148.8,94
  pour L5_PWR (isolate 0.254, rank 3, no thermals): 147.62,78.47 147.62,82.9 155.72,82.9 155.72,78.47
  pour L5_PWR (isolate 0.305, rank 4, no thermals): -4.4,109 49,109 49,97 64,97 64,109 162,109 162,-2 -4.4,-2
+5V  (via drill 0.15)
  L1-HS 0.2: PI1.78 68.2,85.1 PI1.80 68.2,85.5 PI1.82 68.2,85.9 PI1.84 68.2,86.3 PI1.86 68.2,86.72 PI1.88
  L1-HS 0.305: IC5.3 2.52,31.93 C20.1 | C1.1 78.42,101.26 C25.1 78.44,99.11 C24.1 C23.1 C22.1 | 68.2,86.72 64.47,86.72 v64,86.25 | 68.2,86.3 65.05,86.3 v65,86.25 | 68.2,85.9 64.65,85.9 v64,85.25 | 68.2,85.5 65.25,85.5 v65,85.25 | 68.2,85.1 65.85,85.1 v65,84.25 | R20.1 v26.54,23.14 v26.55,23.15 | 17.96,102.4 17.96,102.94 C3.1
  L1-HS 0.406: IC7.1 35.8,24.91 C32.1 | R42.1 125.81,99.34 v125.83,99.33 | C41.1 134.94,87.38 C40.1 | 5VDC.TP 135.62,79.97 v133.9,79.97
  L1-HS 0.508: TP_5VP1.TP 34.09,28.21 35.7,26.59 C32.1 35.73,25.02 36.05,25.02 | C5.1 50.1,24.18 50.67,24.18 | IC2.1 50.3,22.4 50.67,22.4 | C20.1 3.21,32.62 C19.1
  L1-HS 0.61: T5.3 T5.2 T5.1 | C38.1 R42.1
  L1-HS 0.813: 36.05,25.02 36.05,22.75 | C19.1 3.21,35.95 C18.1 3.23,37.6 4.08,38.45 TP-5VP.TP | IC4.1 17.96,102.4 17,102.4 v16.85,102.55
  L1-HS 1.016: TP_5VP1.TP 36.52,29.45 37.75,30.68 v41.8,30.68 | TP_5VP.TP 45.95,29.05 v45.7,29.3 | v30.55,43.17 30.55,38.95 v31.12,38.38
  L1-HS 1.27: TP_5VP.TP 49.52,26.52 50.67,25.38 50.67,24.18 50.67,22.4
  L5_PWR 0.2: v30.55,43.17 v30.54,43.17
  L5_PWR 0.813: v16.85,102.55 17.68,101.72 22.95,101.72 29.12,95.55 61.8,95.55 65.05,92.3 65.1,92.3 65.1,86.35 v65,86.25
  L5_PWR 1.016: v41.8,30.68 43.64,32.51 | 43.64,32.51 45.7,34.58 | 101.97,55.5 101.97,37.1 100.4,35.52 87.6,35.52 81.9,29.82 71.95,29.82 69.15,32.62 60.9,32.62 58.95,34.58 45.7,34.58 | 101.97,55.5 101.97,57.67 | 101.97,57.67 103.51,59.21 | v45.7,29.3 45.7,30.45 43.64,32.51 | v26.55,23.15 29.73,26.32 29.73,36.98 v31.12,38.38 41.9,38.38 45.7,34.58 | v3.5,39 12.5,39 16.12,42.62 30,42.62 v30.54,43.17 | J1.9 104.5,56.03 | 104.5,56.03 103.5,56.03 | 103.5,56.03 102.5,56.03 | 102.5,56.03 101.97,55.5 | 101.97,57.67 101.97,59.35 102.67,60.05 102.67,56.2 102.5,56.03 | 103.5,56.03 103.5,57.91 104.16,58.57 104.16,56.38 104.5,56.03 | 104.5,56.03 105,56.53 105,58.57
  L5_PWR 1.27: 108.52,58 J3.8 J1.8 106.55,58 108.52,58 | 108.52,58 108.52,57 | 108.52,57 J3.9 J1.9 | 105.98,57 108.52,57
  L5_PWR 1.5: GPIO.2 GPIO.4 86.47,82.69 87.8,84.03 87.8,84.17 88.25,84.62 88.25,84.88 | J1.9 105.98,57 J1.8 105,58.57 104.16,58.57 103.51,59.21 102.67,60.05 102.67,80.2 | 132,76.35 131.68,76.67 131.55,76.67
  L5_PWR 3: v133.9,79.97 133.9,79.03 131.55,76.67 114.55,76.67 111.03,80.2 102.67,80.2 88.8,80.2 85.83,83.17 85.83,85.75 83.4,88.17 81.53,88.17 | v79.75,93 79.75,92.67 75.25,88.17 81.53,88.17 | 81.53,88.17 82.45,89.1 86.03,89.1 88.25,86.88 88.25,84.88 90.47,82.65 106.45,82.65 106.97,82.12 106.97,81.08 107.03,81.03
  L6-SS 0.406: v125.83,99.33 133,99.33 133.47,98.85 133.47,90.17 v133,89.7
  other vias: 2.5,39 2.5,38 3.5,38 4.5,38 4.5,39 64,84.25 66,86.25 66,85.25 67,85.25 67,86.25 66,84.25 83.5,102 83.5,101 83.5,100 83.5,99 83.5,98 83.5,97 79.75,99 79.75,100 79.75,101 79.75,102 79.75,103 81,103 82.25,103 83.5,103 79.75,98 79.75,97 79.75,96 79.75,95 79.75,94 132,89.7 132,88.8 133,88.8 134,89.7 135,89.7 134,88.8 135,88.8 133.9,80.97 132.9,80.97 131.9,80.97 130.9,80.97 130.9,79.97 131.9,79.97 132.9,79.97 132.9,78.97 131.9,78.97 130.9,78.97 133.9,78.97 134.9,78.97 135.9,78.97 135.9,79.97 135.9,80.97 134.9,80.97 134.9,79.97
  pour L5_PWR (isolate 0.254, rank 2, no thermals): 1.5,39.5 5.5,39.5 5.5,31.5 1,31.5 1,39.5
  pour L1-HS (isolate 0.254, rank 2, no thermals): 1.5,39.5 5.5,39.5 5.5,31.5 1,31.5 1,39.5
  pour L5_PWR (isolate 0.254, rank 2, no thermals): 83,104.5 84,103.5 84,89 83.5,88.5 78,88.5 73,83.5 64,83.5 63.5,84 63.5,91.5 65,93 69,93 71.5,95.5 71.5,103 73,104.5
  pour L1-HS (isolate 0.254, rank 2, no thermals): 77.5,104.25 83.25,104.25 84,103.5 84,92.75 83.25,92 78,92 77.5,92.5
  pour L1-HS (isolate 0.254, rank 2, no thermals): 63.45,85.17 63.45,84.1 63.98,83.58 64.03,83.53 68.53,83.53 68.7,83.53 68.9,83.72 68.97,83.8 68.97,86.72 68.97,87 68.85,87.12 63.75,87.12 63.55,86.92 63.45,86.83 63.45,85.3
  pour L1-HS (isolate 0.254, rank 3, no thermals): 131.3,92.8 137.3,92.8 137.3,80.5 137.3,78.2 130.7,78.2 129.7,78.2 129.7,92.6 129.7,92.8 131.2,92.8
  pour L5_PWR (isolate 0.254, rank 3, no thermals): 129.62,78.72 129.62,81.9 137.22,81.9 137.22,77.47 129.82,77.47 129.62,77.47
+12V  (via drill 0.15)
  L1-HS 0.254: C54.1 112.06,85.3 v112,85.3 | C53.1 115.61,85.2 v115.7,85.2 | R38.1 C9.1 127.67,88.41 C39.1
  L1-HS 0.406: IC3.2 127.64,90.42 C9.1
  other vias: 113.9,84.9 113.9,83.9 113.9,82.9 113.9,81.9 113.9,80.9 110.4,84.9 110.4,83.9 110.4,82.9 117.4,84.9 117.4,83.9 117.4,82.9 118.9,87.9 118.9,86.9 118.9,85.9 122.4,85.9 122.4,86.9 122.4,87.9 139.4,86.4 138.4,86.4 138.4,85.4 138.4,84.4 139.4,84.4 139.4,85.4 142.9,86.4 143.9,86.4 144.9,86.4 144.9,85.4 143.9,85.4 142.9,85.4 142.9,84.4 143.9,84.4 144.9,84.4
  pour L1-HS (isolate 0.254, rank 2, no thermals): 109.2,88.6 123.4,88.6 123.4,92.7 128.5,92.7 128.5,79.7 109.2,79.7
  pour L1-HS (isolate 0.254, rank 2, no thermals): 140,91.9 146.1,91.9 146.1,84.2 146.1,83.8 138.1,83.8 138.1,91.9 139.7,91.9
  pour L5_PWR (isolate 0.406, rank 2, no thermals): 109,88.5 123.5,88.5 123.5,99.5 146,99.5 146,83.5 128.5,83.5 128.5,79.5 109,79.5
CAM_GPIO0  (via drill 0.15)
  L1-HS 0.2: DISP0.17 6.87,82.56 v7.02,82.71 | v66.53,90.89 66.03,90.38 66.03,89.65 66.78,88.9 PI1.98
  L3-HS 0.2: v7.02,82.71 10.46,82.71 19.32,91.58 19.32,95.12 20.73,96.53 38.6,96.53 44.23,90.89 v66.53,90.89
CAM_GPIO1  (via drill 0.15)
  L1-HS 0.2: DISP0.18 4.04,83.06 v4.1,83 | PI1.99 70.78,89.36 v70.78,90.38
  L3-HS 0.2: v70.78,90.38 70.33,90.83 69.4,90.83 68.72,91.5 66.28,91.5 66.06,91.28 44.4,91.28 38.76,96.92 20.56,96.92 18.93,95.29 18.93,91.74 11.6,84.4 5.72,84.4 4.33,83 v4.1,83
CC1  (via drill 0.15)
  L1-HS 0.2: USBC.A5 v98.44,95.45 R25.1 | PI1.93 71.98,88.1 72.24,88.36 72.53,88.36 v73.03,88.87
  L3-HS 0.2: v73.03,88.87 73.49,88.87 73.78,89.16 95.83,89.16 97.85,91.17 97.85,92.03 97.83,92.05 97.83,92.56 97.85,92.57 97.85,94.86 v98.44,95.45
CC2  (via drill 0.15)
  L1-HS 0.2: USBC.B5 v95.44,95.35 R26.1 | PI1.95 71.83,88.5 72.41,89.08 v72.41,90.66
  L3-HS 0.2: v72.41,90.66 72.83,90.24 94.69,90.24 95.74,91.29 95.74,91.94 95.86,92.07 95.86,94.92 v95.44,95.35
DPHY1_DSIC_N  (2 unrouted)
  L1-HS 0.121: DISP0.8 6.71,78.06 6.8,78.14 10.46,78.14 arc-90 10.62,77.99 10.62,77.83 arc90 11.09,77.36 12.6,77.36 arc90 13.06,77.83 arc-90 13.22,77.98 13.27,77.98 arc-90 13.43,77.83 arc90 13.9,77.36 13.95,77.36 arc90 14.42,77.83 14.42,77.96 arc-90 14.57,78.12 14.62,78.12 arc-90 14.78,77.96 14.78,77.83 arc90 15.25,77.36 15.3,77.36 arc90 15.77,77.83 15.77,77.99 arc-90 15.92,78.14 15.97,78.14 arc-90 16.13,77.99 16.13,77.83 arc90 16.6,77.36 16.65,77.36 arc90 17.12,77.83 17.12,77.99 arc-90 17.27,78.14 17.33,78.14 arc-90 17.48,77.99 17.48,77.83 arc90 17.95,77.36 18,77.36 arc90 18.47,77.83 18.47,77.99 arc-90 18.62,78.14 19.41,78.14 28.16,86.89 33.33,86.89 33.36,86.86 PI1.188
DPHY1_DSIC_P  (2 unrouted)
  L1-HS 0.121: DISP0.9 6.7,78.56 6.8,78.46 10.46,78.46 arc-90 10.93,77.99 10.93,77.83 arc90 11.09,77.67 11.14,77.67 arc90 11.3,77.83 11.3,78.3 arc-90 11.45,78.46 11.51,78.46 arc-90 11.66,78.3 11.66,77.83 arc90 11.82,77.67 11.87,77.67 arc90 12.03,77.83 12.03,78.3 arc-90 12.18,78.46 12.23,78.46 arc-90 12.39,78.3 12.39,77.83 arc90 12.54,77.67 12.6,77.67 arc90 12.75,77.83 12.75,77.99 arc-90 13.22,78.46 13.27,78.46 arc-90 13.74,77.99 13.74,77.83 arc90 13.9,77.67 13.95,77.67 arc90 14.1,77.83 14.1,77.99 arc-90 14.57,78.46 14.62,78.46 arc-90 15.09,77.99 15.09,77.83 arc90 15.25,77.67 15.3,77.67 arc90 15.46,77.83 15.46,77.99 arc-90 15.92,78.46 15.97,78.46 arc-90 16.44,77.99 16.44,77.83 arc90 16.6,77.67 16.65,77.67 arc90 16.81,77.83 16.81,77.99 arc-90 17.27,78.46 17.33,78.46 arc-90 17.79,77.99 17.79,77.83 arc90 17.95,77.67 18,77.67 arc90 18.16,77.83 18.16,77.99 arc-90 18.62,78.46 19.29,78.46 28.04,87.21 33.33,87.21 33.38,87.26 PI1.190
DPHY1_DSID0_N  (2 unrouted)
  L1-HS 0.121: PI1.176 33.43,84.46 33.4,84.49 28.86,84.49 19.51,75.14 15.96,75.14 arc90 15.8,74.99 15.8,74.14 arc-90 15.34,73.68 14.16,73.68 arc-90 13.7,74.14 13.7,74.86 arc90 13.54,75.02 13.36,75.02 arc90 13.2,74.86 13.2,74.14 arc-90 12.73,73.68 12.55,73.68 arc-90 12.08,74.14 12.08,74.99 arc90 11.93,75.14 7.86,75.14 7.78,75.06 DISP0.2
DPHY1_DSID0_P  (2 unrouted)
  L1-HS 0.121: PI1.178 33.45,84.86 33.4,84.81 28.74,84.81 19.39,75.46 15.96,75.46 arc90 15.49,74.99 15.49,74.14 arc-90 15.34,73.99 15.15,73.99 arc-90 15,74.14 15,75.3 arc90 14.84,75.46 14.66,75.46 arc90 14.5,75.3 14.5,74.14 arc-90 14.35,73.99 14.16,73.99 arc-90 14.01,74.14 14.01,74.99 arc90 13.54,75.46 13.36,75.46 arc90 12.89,74.99 12.89,74.14 arc-90 12.73,73.99 12.55,73.99 arc-90 12.39,74.14 12.39,74.99 arc90 11.93,75.46 7.74,75.46 7.67,75.39 5.9,75.39 DISP0.3
DPHY1_DSID1_N  (2 unrouted)
  L1-HS 0.121: DISP0.5 6.62,76.56 6.72,76.67 11.32,76.67 arc-90 11.48,76.51 11.48,76.25 arc90 11.95,75.78 11.99,75.78 arc90 12.46,76.25 12.46,76.51 arc-90 12.61,76.67 12.65,76.67 arc-90 12.81,76.51 12.81,76.25 arc90 13.27,75.78 13.31,75.78 arc90 13.78,76.25 13.78,76.51 arc-90 13.94,76.67 13.98,76.67 arc-90 14.13,76.51 14.13,76.25 arc90 14.6,75.78 14.64,75.78 arc90 15.11,76.25 15.11,76.51 arc-90 15.26,76.67 15.3,76.67 arc-90 15.46,76.51 15.46,76.25 arc90 15.92,75.78 15.96,75.78 arc90 16.43,76.25 16.43,76.51 arc-90 16.59,76.67 16.63,76.67 arc-90 16.78,76.51 16.78,76.25 arc90 17.25,75.78 17.29,75.78 arc90 17.76,76.25 17.76,76.51 arc-90 17.91,76.67 17.95,76.67 arc-90 18.11,76.51 18.11,75.94 arc90 18.26,75.78 18.3,75.78 arc90 18.46,75.94 18.46,76.51 arc-90 18.61,76.67 19.39,76.67 28.41,85.69 33.3,85.69 33.33,85.66 PI1.182
DPHY1_DSID1_P  (2 unrouted)
  L1-HS 0.121: DISP0.6 6.65,77.06 6.72,76.98 11.32,76.98 arc-90 11.79,76.51 11.79,76.25 arc90 11.95,76.1 11.99,76.1 arc90 12.14,76.25 12.14,76.51 arc-90 12.61,76.98 12.65,76.98 arc-90 13.12,76.51 13.12,76.25 arc90 13.27,76.1 13.31,76.1 arc90 13.47,76.25 13.47,76.51 arc-90 13.94,76.98 13.98,76.98 arc-90 14.44,76.51 14.44,76.48 arc90 14.6,76.32 14.64,76.32 arc90 14.79,76.48 14.79,76.51 arc-90 15.26,76.98 15.3,76.98 arc-90 15.77,76.51 arc90 15.92,76.36 15.96,76.36 arc90 16.12,76.51 arc-90 16.59,76.98 16.63,76.98 arc-90 17.09,76.51 arc90 17.25,76.36 17.29,76.36 arc90 17.45,76.51 arc-90 17.91,76.98 19.26,76.98 28.29,86.01 33.3,86.01 33.35,86.06 PI1.184
DPHY1_DSID2_N  (2 unrouted)
  L1-HS 0.121: DISP0.11 6.67,79.56 6.78,79.67 13.05,79.67 arc90 13.52,80.14 13.52,80.21 arc-90 13.67,80.37 13.8,80.37 arc-90 13.96,80.21 13.96,79.44 arc90 14.43,78.97 14.55,78.97 arc90 15.02,79.44 15.02,80.21 arc-90 15.18,80.37 15.31,80.37 arc-90 15.46,80.21 15.46,79.44 arc90 15.93,78.97 16.06,78.97 arc90 16.52,79.44 16.52,80.21 arc-90 16.68,80.37 16.81,80.37 arc-90 16.96,80.21 16.96,79.13 arc90 17.12,78.97 17.25,78.97 arc90 17.41,79.13 17.41,80.21 arc-90 17.56,80.37 17.69,80.37 arc-90 17.85,80.21 17.85,80.14 arc90 18.31,79.67 19.09,79.67 27.54,88.12 33.33,88.12 33.38,88.06 PI1.194
DPHY1_DSID2_P  (2 unrouted)
  L1-HS 0.121: DISP0.12 6.7,80.06 6.78,79.98 13.05,79.98 arc90 13.21,80.14 13.21,80.21 arc-90 13.67,80.68 13.8,80.68 arc-90 14.27,80.21 14.27,79.44 arc90 14.43,79.28 14.55,79.28 arc90 14.71,79.44 14.71,80.21 arc-90 15.18,80.68 15.31,80.68 arc-90 15.77,80.21 15.77,79.67 arc90 15.93,79.51 16.06,79.51 arc90 16.21,79.67 16.21,80.21 arc-90 16.68,80.68 17.69,80.68 arc-90 18.16,80.21 18.16,80.14 arc90 18.31,79.98 18.96,79.98 27.41,88.43 33.33,88.43 33.35,88.46 PI1.196
DPHY1_DSID3_N  (2 unrouted)
  L1-HS 0.121: DISP0.14 6.72,81.06 6.8,81.14 12.3,81.14 arc90 12.77,81.61 12.77,81.78 arc-90 12.92,81.94 13.29,81.94 arc-90 13.44,81.78 13.44,81.61 arc90 13.91,81.14 18.89,81.14 27.49,89.74 35.14,89.74 35.64,89.24 35.64,88.41 35.97,88.08 36.87,88.08 PI1.193
DPHY1_DSID3_P  (2 unrouted)
  L1-HS 0.121: DISP0.15 6.7,81.56 6.8,81.46 12.3,81.46 arc90 12.46,81.61 12.46,82.2 arc-90 12.92,82.67 13.29,82.67 arc-90 13.76,82.2 13.76,81.61 arc90 13.91,81.46 14.28,81.46 arc90 14.43,81.61 14.43,82.51 arc-90 14.59,82.67 14.95,82.67 arc-90 15.11,82.51 15.11,81.61 arc90 15.26,81.46 18.76,81.46 27.36,90.06 35.26,90.06 35.96,89.36 35.96,88.54 36.07,88.42 36.86,88.42 PI1.195
EEPROM_NWP  (via drill 0.15)
  L1-HS 0.2: v73.12,73.5 72.93,73.3 PI1.19
  L6-SS 0.2: SJ1.2 73.12,67.17 72.28,68.03 72.28,71.67 73.15,72.55 73.15,73.47 v73.12,73.5
ETH_LEDG  (via drill 0.15)
  L1-HS 0.2: R8.1 86.08,30.14 v86.33,30.38 | PI1.18 65.25,72.9 v65.15,72.8
  L6-SS 0.2: v86.33,30.38 85.88,30.38 85.44,30.82 72.74,30.82 70.74,32.81 70.74,41.11 65.44,46.41 65.44,71.19 65.72,71.47 65.72,72.23 v65.15,72.8
ETH_LEDY  (via drill 0.15)
  L1-HS 0.2: PI1.16 65.72,72.5 v65.1,71.88 | v95.7,30.23 95.74,30.18 R9.2
  L6-SS 0.2: v65.1,71.88 65.05,71.83 65.05,46.25 70.35,40.95 70.35,32.65 72.58,30.43 85.28,30.43 86.65,29.05 94.53,29.05 v95.7,30.23
ETH_TX1_N  (via drill 0.15)  (2 unrouted)
  L1-HS 0.121: ETH1.TD1- 86.95,22.68 86.78,22.85 86.78,23.71 87.73,24.66 87.73,30.84 86.96,31.61 78.89,31.61 74.96,35.54 74.96,39.53 arc90 74.49,40 73.75,40 arc-90 73.59,40.16 73.59,40.17 arc-90 73.75,40.32 74.49,40.32 arc90 74.96,40.79 74.96,40.8 arc90 74.49,41.27 73.75,41.27 arc-90 73.59,41.43 73.59,41.44 arc-90 73.75,41.6 74.49,41.6 arc90 74.96,42.06 74.96,42.08 arc90 74.49,42.54 73.75,42.54 arc-90 73.59,42.7 73.59,42.71 arc-90 73.75,42.87 74.49,42.87 arc90 74.96,43.34 74.96,43.35 arc90 74.49,43.81 73.75,43.81 arc-90 73.59,43.97 73.59,43.98 arc-90 73.75,44.14 74.49,44.14 arc90 74.96,44.61 74.96,44.62 arc90 74.49,45.09 73.75,45.09 arc-90 73.59,45.24 73.59,45.26 arc-90 73.75,45.41 74.49,45.41 arc90 74.96,45.88 74.96,45.89 arc90 74.49,46.36 73.75,46.36 arc-90 73.59,46.51 73.59,46.53 arc-90 73.75,46.68 74.49,46.68 arc90 74.96,47.15 74.96,70.84 75.24,71.12 75.73,71.12 v76,70.86 | v74.05,71.28 74.05,71.54 73.32,71.54 73.1,71.33 71.78,71.33 71.76,71.3 PI1.9
  L3-HS 0.121: v76,70.86 76,71.12 74.91,71.12 74.49,71.54 74.05,71.54 v74.05,71.28
ETH_TX1_P  (via drill 0.15)  (2 unrouted)
  L1-HS 0.121: ETH1.TD1+ 86.3,22.68 86.47,22.85 86.47,23.84 87.42,24.79 87.42,30.71 86.84,31.29 78.76,31.29 74.64,35.41 74.64,39.53 arc90 74.49,39.69 73.75,39.69 arc-90 73.28,40.16 73.28,40.17 arc-90 73.75,40.64 74.23,40.64 arc90 74.38,40.79 74.38,40.8 arc90 74.23,40.96 73.75,40.96 arc-90 73.28,41.43 73.28,41.44 arc-90 73.75,41.91 74.49,41.91 arc90 74.64,42.06 74.64,42.08 arc90 74.49,42.23 73.75,42.23 arc-90 73.28,42.7 73.28,42.71 arc-90 73.75,43.18 74.49,43.18 arc90 74.64,43.34 74.64,43.35 arc90 74.49,43.5 73.75,43.5 arc-90 73.28,43.97 73.28,43.98 arc-90 73.75,44.45 74.49,44.45 arc90 74.64,44.61 74.64,44.62 arc90 74.49,44.77 73.75,44.77 arc-90 73.28,45.24 73.28,45.26 arc-90 73.75,45.72 74.49,45.72 arc90 74.64,45.88 74.64,45.89 arc90 74.49,46.05 73.75,46.05 arc-90 73.28,46.51 73.28,46.53 arc-90 73.75,46.99 74.49,46.99 arc90 74.64,47.15 74.64,70.96 75.11,71.43 75.73,71.43 v76,71.69 | v74.05,72.12 74.05,71.86 73.18,71.86 72.98,71.66 71.8,71.66 71.76,71.7 PI1.11
  L3-HS 0.121: v76,71.69 76,71.43 75.04,71.43 74.61,71.86 74.05,71.86 v74.05,72.12
ETH_TX2_N  (via drill 0.15)  (2 unrouted)
  L1-HS 0.121: ETH1.TD2- 87.34,20.14 87.47,20.27 87.47,20.99 88.92,22.44 88.92,31.29 87.79,32.42 79.06,32.42 75.37,36.11 75.37,42.12 arc-90 75.84,42.59 76.57,42.59 arc90 76.72,42.75 76.72,42.84 arc90 76.57,42.99 75.84,42.99 arc-90 75.37,43.46 75.37,43.55 arc-90 75.84,44.02 76.57,44.02 arc90 76.72,44.17 76.72,44.26 arc90 76.57,44.42 75.84,44.42 arc-90 75.37,44.88 75.37,44.98 arc-90 75.84,45.44 76.57,45.44 arc90 76.72,45.6 76.72,45.69 arc90 76.57,45.84 75.84,45.84 arc-90 75.37,46.31 75.37,46.4 arc-90 75.84,46.87 76.31,46.87 arc90 76.47,47.02 76.47,47.11 arc90 76.31,47.27 75.84,47.27 arc-90 75.37,47.74 75.37,47.83 arc-90 75.84,48.29 76.57,48.29 arc90 76.72,48.45 76.72,48.54 arc90 76.57,48.69 75.84,48.69 arc-90 75.37,49.16 75.37,69.34 75.79,69.76 76.38,69.76 76.58,69.96 v76.58,70.02 | PI1.5 71.68,70.5 71.72,70.46 73.03,70.46 v73.03,70.72
  L3-HS 0.121: v73.03,70.72 73.03,70.46 74.11,70.46 74.81,69.76 76.58,69.76 v76.58,70.02
ETH_TX2_P  (via drill 0.15)  (2 unrouted)
  L1-HS 0.121: ETH1.TD2+ 87.91,20.14 87.78,20.27 87.78,20.86 89.23,22.31 89.23,31.41 87.91,32.73 79.19,32.73 75.68,36.24 75.68,42.12 arc-90 75.84,42.28 76.57,42.28 arc90 77.03,42.75 77.03,42.84 arc90 76.57,43.3 75.84,43.3 arc-90 75.68,43.46 75.68,43.55 arc-90 75.84,43.71 76.57,43.71 arc90 77.03,44.17 77.03,44.26 arc90 76.57,44.73 75.84,44.73 arc-90 75.68,44.88 75.68,44.98 arc-90 75.84,45.13 76.57,45.13 arc90 77.03,45.6 77.03,45.69 arc90 76.57,46.16 75.84,46.16 arc-90 75.68,46.31 75.68,46.4 arc-90 75.84,46.56 76.57,46.56 arc90 77.03,47.02 77.03,47.11 arc90 76.57,47.58 75.84,47.58 arc-90 75.68,47.74 75.68,47.83 arc-90 75.84,47.98 76.57,47.98 arc90 77.03,48.45 77.03,48.54 arc90 76.57,49.01 75.84,49.01 arc-90 75.68,49.16 75.68,69.21 75.91,69.44 76.38,69.44 76.58,69.24 v76.58,69.18 | PI1.3 71.68,70.1 71.72,70.14 73.03,70.14 v73.03,69.88
  L3-HS 0.121: v73.03,69.88 73.03,70.14 73.99,70.14 74.69,69.44 76.58,69.44 v76.58,69.18
ETH_TX3_N  (via drill 0.15)  (2 unrouted)
  L1-HS 0.121: ETH1.TD3- 91.96,20.14 91.86,20.25 91.86,20.96 90.46,22.36 90.46,31 v90.72,31 | PI1.10 67.39,71.3 67.35,71.34 66.29,71.34 65.76,70.81 65.76,65.62 arc-90 65.29,65.15 65.1,65.15 arc90 64.94,65 64.94,64.87 arc90 65.1,64.71 65.29,64.71 arc-90 65.76,64.25 65.76,64.11 arc-90 65.29,63.65 65.1,63.65 arc90 64.94,63.49 64.94,63.36 arc90 65.1,63.21 65.29,63.21 arc-90 65.76,62.74 65.76,62.61 arc-90 65.29,62.14 65.1,62.14 arc90 64.94,61.98 64.94,61.85 arc90 65.1,61.7 65.29,61.7 arc-90 65.76,61.23 65.76,61.1 arc-90 65.29,60.63 65.1,60.63 arc90 64.94,60.48 64.94,60.35 arc90 65.1,60.19 65.29,60.19 arc-90 65.76,59.73 65.76,41.59 71.98,35.36 71.98,33.54 73.16,32.36 74.15,32.36 v74.15,32.62
  L3-HS 0.121: v74.15,32.62 74.15,32.36 89.56,32.36 90.46,31.46 90.46,31 v90.72,31
ETH_TX3_P  (via drill 0.15)  (2 unrouted)
  L1-HS 0.121: ETH1.TD3+ 91.44,20.14 91.54,20.25 91.54,20.84 90.14,22.24 90.14,31 v89.88,31 | PI1.12 67.39,71.7 67.35,71.66 66.16,71.66 65.44,70.94 65.44,65.62 arc-90 65.29,65.47 65.1,65.47 arc90 64.63,65 64.63,64.87 arc90 65.1,64.4 arc-90 65.25,64.25 65.25,64.11 arc-90 65.1,63.96 arc90 64.63,63.49 64.63,63.36 arc90 65.1,62.89 65.21,62.89 arc-90 65.37,62.74 65.37,62.61 arc-90 65.21,62.45 65.1,62.45 arc90 64.63,61.98 64.63,61.85 arc90 65.1,61.39 65.29,61.39 arc-90 65.44,61.23 65.44,61.1 arc-90 65.29,60.95 65.1,60.95 arc90 64.63,60.48 64.63,60.35 arc90 65.1,59.88 65.29,59.88 arc-90 65.44,59.73 65.44,41.46 71.67,35.24 71.67,33.41 73.04,32.04 74.15,32.04 v74.15,31.78
  L3-HS 0.121: v74.15,31.78 74.15,32.04 89.44,32.04 90.14,31.34 90.14,31 v89.88,31
ETH_TX4_N  (via drill 0.15)  (2 unrouted)
  L1-HS 0.121: ETH1.TD4- 92.45,22.68 92.59,22.82 92.59,23.51 91.62,24.49 91.62,31.8 v91.36,31.8 | v74.83,33.28 74.83,33.54 73.74,33.54 72.77,34.51 72.77,35.64 66.47,41.94 66.47,57.67 arc-90 66.94,58.14 67.46,58.14 arc90 67.61,58.3 67.61,58.3 arc90 67.46,58.46 66.94,58.46 arc-90 66.47,58.93 66.47,58.93 arc-90 66.94,59.4 67.46,59.4 arc90 67.61,59.55 67.61,59.56 arc90 67.46,59.72 66.94,59.72 arc-90 66.47,60.18 66.47,60.19 arc-90 66.94,60.65 67.46,60.65 arc90 67.61,60.81 67.61,60.81 arc90 67.46,60.97 66.94,60.97 arc-90 66.47,61.44 66.47,61.44 arc-90 66.94,61.91 67.16,61.91 arc90 67.32,62.07 67.32,62.07 arc90 67.16,62.23 66.94,62.23 arc-90 66.47,62.69 66.47,62.7 arc-90 66.94,63.17 67.46,63.17 arc90 67.61,63.32 67.61,63.33 arc90 67.46,63.48 66.94,63.48 arc-90 66.47,63.95 66.47,70.06 66.86,70.46 67.35,70.46 67.39,70.5 PI1.6
  L3-HS 0.121: v91.36,31.8 91.62,31.8 91.62,32.44 90.51,33.54 74.83,33.54 v74.83,33.28
ETH_TX4_P  (via drill 0.15)  (2 unrouted)
  L1-HS 0.121: ETH1.TD4+ 93.05,22.68 92.91,22.82 92.91,23.64 91.93,24.61 91.93,31.8 v92.19,31.8 | v74.83,34.12 74.83,33.86 73.86,33.86 73.08,34.64 73.08,35.76 66.78,42.06 66.78,57.67 arc-90 66.94,57.83 67.46,57.83 arc90 67.93,58.3 67.93,58.3 arc90 67.46,58.77 66.94,58.77 arc-90 66.78,58.93 66.78,58.93 arc-90 66.94,59.09 67.46,59.09 arc90 67.93,59.55 67.93,59.56 arc90 67.46,60.03 66.94,60.03 arc-90 66.78,60.18 66.78,60.19 arc-90 66.94,60.34 67.46,60.34 arc90 67.93,60.81 67.93,60.81 arc90 67.46,61.28 66.94,61.28 arc-90 66.78,61.44 66.78,61.44 arc-90 66.94,61.6 67.46,61.6 arc90 67.93,62.07 67.93,62.07 arc90 67.46,62.54 66.94,62.54 arc-90 66.78,62.69 66.78,62.7 arc-90 66.94,62.85 67.46,62.85 arc90 67.93,63.32 67.93,63.33 arc90 67.46,63.79 66.94,63.79 arc-90 66.78,63.95 66.78,69.94 66.99,70.14 67.35,70.14 67.39,70.1 PI1.4
  L3-HS 0.121: v92.19,31.8 91.93,31.8 91.93,32.56 90.64,33.86 74.83,33.86 v74.83,34.12
GND  (via drill 0.15, 3.2)
  L1-HS 0.18: v41.07,14.75 41.04,14.72 D13.8 D13.3 | DISP0.19 7.06,83.56 v7.08,83.55 | DISP0.13 v7.24,80.56 v7.25,80.57 | DISP0.16 1.46,82.06 v1.45,82.05 | DISP0.10 1.44,79.06 v1.43,79.08 | DISP0.4 1.42,76.06 v1.4,76.08 | DISP0.7 v7.2,77.56 | v7.55,79.08 7.57,79.06 D8.3 D8.8 10.98,79.06 v11,79.08 | v7.55,82.05 v7.56,82.06 D9.3 D9.8 v10.69,82.06 v10.7,82.05 | v37.12,45.83 37.11,45.81 C27.2 36.32,45.7 X1.2 v37.67,44.2 | v33.9,40.35 C26.2 34.83,41.9 X1.4 v33.48,42.01 v33.48,42 | D15.8 60.62,19.39 v60.73,19.5 | D14.3 64.06,15.74 64.68,15.12 64.68,14.88 v64.92,14.64 | D16.3 67.89,22.09 v67.65,22.32 | IC1.2 119.52,11.68 C50.2 117.86,10.81 v117.88,10.8 | C49.2 116.1,11.36 v116.1,10.3 | C10.2 119.52,16.5 v119.5,16.52 | C56.2 v121.6,16.52 | C55.2 123.4,17.4 v123.33,17.48
  L1-HS 0.2: PI1.198 34.99,88.86 35.23,88.62 35.23,87.73 35.3,87.66 | PI1.192 35.3,87.66 | 35.3,87.66 35.6,87.66 PI1.191 | v91.04,30.02 91.04,28.97 D1.3 D1.8 91.04,28.09 v91.04,26.25 | v88.31,30.05 88.33,30.02 D2.8 D2.3 v88.33,26.26 v88.34,26.25 | PI1.97 69.53,88.9 69.5,88.88 | PI1.72 69.47,83.7 69.5,83.72 | PI1.73 69.5,84.1 | PI1.66 69.47,82.5 69.5,82.53 69.53,82.5 PI1.65 | PI1.60 69.47,81.3 69.5,81.33 69.53,81.3 PI1.59 | PI1.54 69.47,80.1 69.5,80.12 | PI1.51 69.53,79.7 69.5,79.67 | PI1.44 69.47,78.1 69.5,78.08 | PI1.41 69.55,77.7 69.5,77.65 | PI1.34 69.5,76.1 | PI1.31 69.6,75.7 69.5,75.6 | PI1.24 69.47,74.1 69.5,74.08 | PI1.21 69.58,73.7 69.5,73.62 | PI1.13 69.55,72.1 v69.5,72.05 69.45,72.1 PI1.14 | PI1.8 69.45,70.9 | 69.45,70.9 69.5,70.95 | PI1.7 69.58,70.9 v69.5,70.83 69.5,70.85 69.45,70.9 | PI1.2 69.42,69.7 69.5,69.62 69.58,69.7 PI1.1 | USBC.A12 93.99,97.45 USBC.B1 | USBC.B12 100.39,97.45 USBC.A1 | DISP0.25 | DISP0.25 DISP0.23 7.08,86.06 v7.12,86.1 | DISP0.25 2.87,86.05 v1.23,86.05 | PI1.107 35.64,70.86 v35.62,70.88 | PI1.108 35.61,70.86 v35.62,70.88 | 35.6,73.26 35.6,72.05 | 35.6,72.05 35.6,72.03 | 35.6,72.03 35.6,70.9 v35.62,70.88 | PI1.114 35.59,72.06 35.6,72.05 | PI1.113 35.63,72.06 35.6,72.03 | HDMI2.17 v12.62,99.39 v12.62,99.4 | HDMI2.11 10.22,99.42 v10.28,99.47 | HDMI2.8 v9.03,99.45 | HDMI2.2 v6.62,99.42 | HDMI2.5 7.82,99.43 v7.8,99.45 | D3.8 v6.82,93.58 v6.81,93.58 | D4.8 10.02,93.6 v10.04,93.58 | D7.3 8.13,76.06 v8.1,76.03 | 35.6,84.06 35.59,84.05 v35.59,84 | DISP0.26 | DISP0.26 DISP0.24 5.7,73.56 | 5.7,73.56 7.14,73.56 v7.2,73.5 | DISP0.26 1.14,73.56 v1.1,73.6 | DISP0.1 5.7,74.53 5.7,73.56 | C17.2 10.81,25.42 v10.81,26.6
  L1-HS 0.203: PI1.120 35.6,73.26 | 35.6,73.26 PI1.119 | PI1.126 35.59,74.46 35.6,74.47 35.62,74.46 | PI1.125 35.62,74.46 | PI1.132 35.56,75.66 35.6,75.62 | PI1.131 35.63,75.66 35.62,75.64 | 35.62,75.64 35.6,75.62 | PI1.138 35.56,76.86 | 35.56,76.86 35.6,76.83 35.6,75.62 | PI1.137 35.58,76.86 | 35.58,76.86 35.56,76.86 | PI1.143 35.64,78.06 | 35.64,78.06 35.6,78.1 | PI1.149 35.62,79.26 35.6,79.28 35.58,79.25 | PI1.155 35.62,80.46 35.6,80.47 v35.59,80.46 | PI1.156 v35.59,80.46 | PI1.161 35.64,81.66 35.6,81.7 35.56,81.66 | PI1.162 35.56,81.66 | PI1.168 35.54,82.86 | 35.54,82.86 35.6,82.8 35.66,82.86 PI1.167 | PI1.179 35.63,85.26 35.6,85.22 v35.56,85.26 | PI1.180 v35.56,85.26 | PI1.186 35.59,86.46 | 35.59,86.46 35.6,86.47 35.62,86.46 PI1.185 | 35.62,74.46 35.62,73.28 35.6,73.26 | 35.62,74.46 35.62,75.64 | 35.58,76.86 35.58,78 | 35.58,78 35.64,78.06 | 35.58,78 35.58,79.25 | 35.58,79.25 v35.58,80.45 v35.59,80.46 | v35.59,80.46 35.59,81.64 | 35.59,81.64 35.59,82.85 | 35.59,82.85 v35.59,84 35.59,85.25 | 35.59,85.25 35.59,86.46 | 35.54,82.86 35.58,82.86 35.59,82.85 | 35.56,81.66 35.59,81.64 | v35.56,85.26 v35.58,85.26 35.59,85.25 | PI1.174 35.6,84.06 PI1.173 | 35.59,86.46 35.59,87.64 35.6,87.66 | PI1.197 37.79,88.86 38.25,88.4 v38.25,88.1 37.81,87.66 PI1.191 | D15.3 D15.8 | X2.2 0.72,13.23 v0.7,13.25 | C14.2 1.5,14.64 v1.52,14.62 | C15.2 3.78,14.57 v3.8,14.55 | C16.2 v6.08,14.55 | PCIE.57 v15.1,1.82 | PCIE.51 v16.6,1.82 | PCIE.45 v18.1,1.82 | PCIE.39 v19.6,1.82 | PCIE.33 v21.1,1.82 | PCIE.27 v22.6,1.82 | PCIE.21 v24.1,1.82 | PCIE.9 v27.1,1.82 | PCIE.15 v25.6,1.82 | v28.6,1.82 PCIE.3 PCIE.1 29.7,3.19 30.2,3.7 PCIE.S1 | PCIE.75 9.8,3.19 9.5,3.5 PCIE.S2
  L1-HS 0.254: IC5.8 3.52,29.39 3.38,29.52 IC5.9 2.28,29.52 2.02,29.79 IC5.4 | PCIE.75 PCIE.73 | PCIE.73 PCIE.71 | PCIE.73 v11.1,1.82 | R39.2 v123.03,92.84 v123.03,92.85 | R43.2 123.83,94.06 v123.8,94.03 | IC3.4 128.94,90.41 C9.2 | T7.2 v104.65,8.85 | T6.2 109.16,8.85 R35.2 109.51,9.37 v109.5,9.38 | T8.2 v103.58,13.55 | 2260.1 v14.93,67.25 | 2260.1 24.37,67.25 v24.4,67.28 | 2260.1 19.85,71.5 v19.8,71.55 | v12.47,49.25 12.49,49.26 2242.1 23.79,49.26 v23.8,49.27 | 2230.1 19.78,37.12 v15.2,37.12 | 2230.1 23.75,37.2 v23.82,37.12 | 2230.1 19.85,33.3 v19.8,33.25
  L1-HS 0.305: C11.2 79.72,27.2 v79.65,27.27 | R28.2 80.86,95.99 v80.88,96 | C22.2 75.03,94.72 v75,94.75 | C23.2 76.47,96.97 v75.03,96.97 | C24.2 v75.08,99.1 | C25.2 75.07,101.25 v75.05,101.22 | C1.2 75.16,103.47 v75.08,103.55 | R27.2 86.14,92.91 v86.12,92.9 | USBC.S2 93.44,97.45 USBC.A12 | USBC.S1 100.94,97.45 USBC.A1 | C2.2 103.38,94.38 v103.42,94.42 | R25.2 v98.44,92.31 v98.45,92.3 | R26.2 95.44,92.52 v95.25,92.33 | C4.2 20.2,97.95 v20.23,97.97 | IC4.3 v21.4,100.42 | C3.2 20.2,102.95 v20.23,102.97 | C21.2 v48.4,44.51 v48.4,44.5 | R29.2 47.52,41.1 v48.4,41.1